# EAGLE design kicker (EAGLE 7.7.0)
DDRAWN: 4/30/17; FINISH: HASL; MATERIAL: FR-4; NDRAWN: RO; REV: 2.1; SCALE: 1:1; TITLE: SSL Kicker

## Sheet 1 of 7: Power Distribution
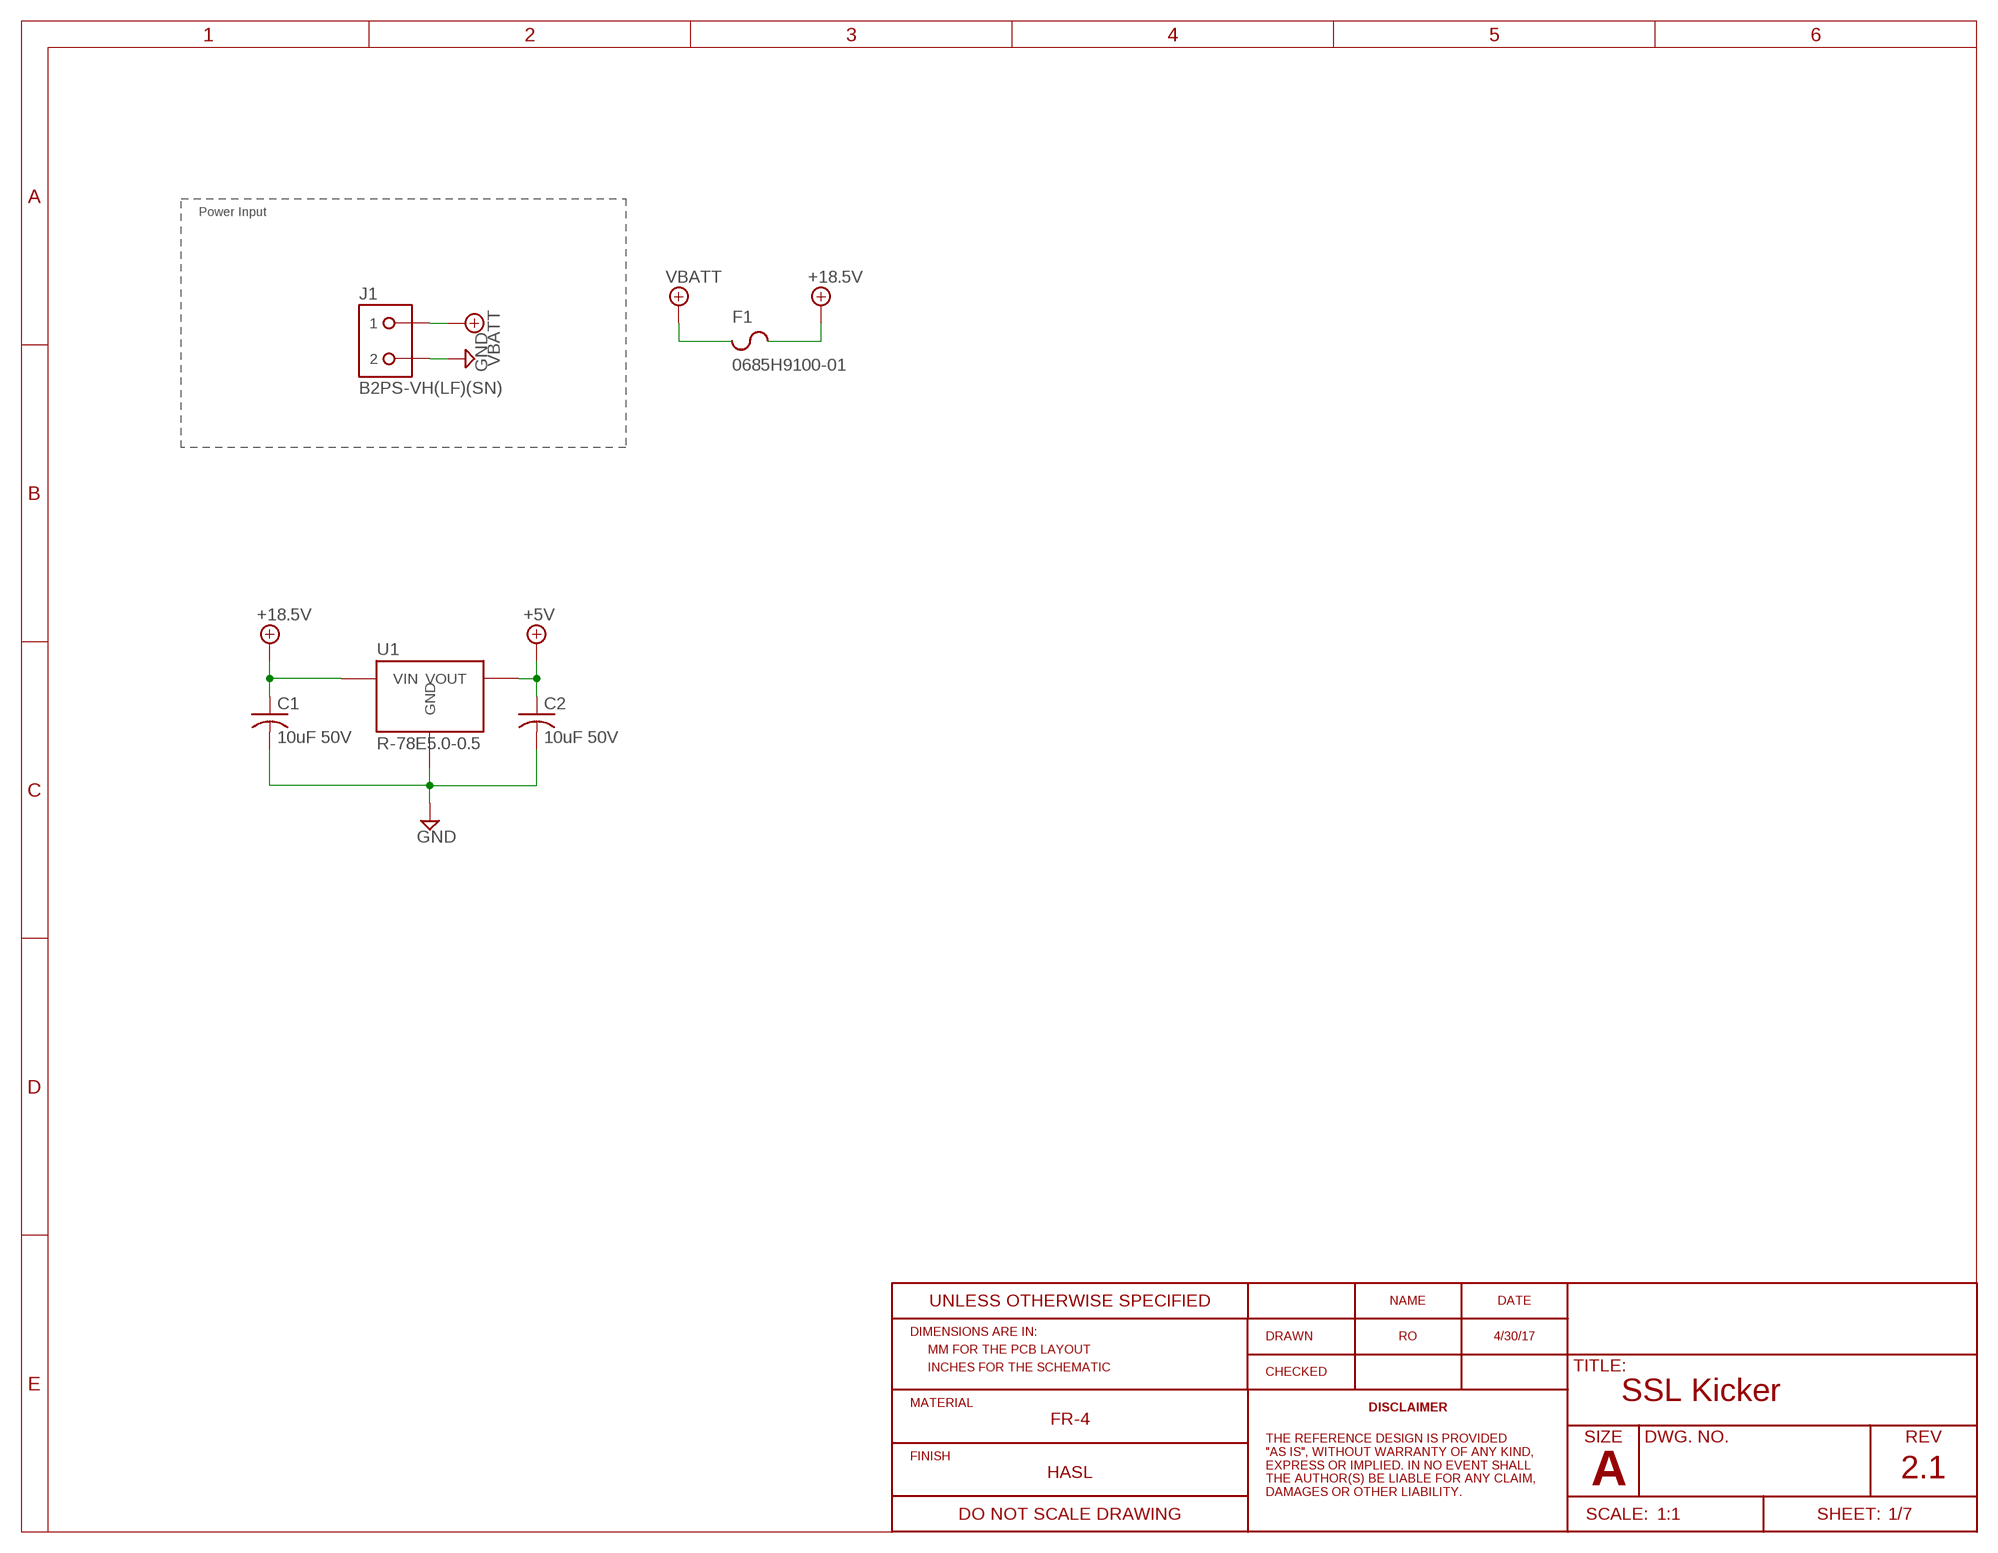
[diagram p0: schematic, sheet 1]

### Parts
C1  10uF 50V  C-USC0603  [C0603]
C2  10uF 50V  C-USC0603  [C0603]
F1  0685H9100-01  CHIP_FUSE1206  [F1206]
J1  B2PS-VH(LF)(SN)  [B2PS-CENTERED]
U1  R-78E5.0-0.5  [R-78E]

### Nets
+5V: C2.1 U1.3(VOUT) ; also sheet 3,5,6,7
+18.5V: C1.1 F1.2 U1.1(VIN) ; also sheet 2,3,4,5
GND: C1.2 C2.2 J1.2 U1.2(GND) ; also sheet 2,3,4,5,6,7
VBATT: F1.1 J1.1

### Notes on the sheet
- Power Input

## Sheet 2 of 7: High Voltage Converter
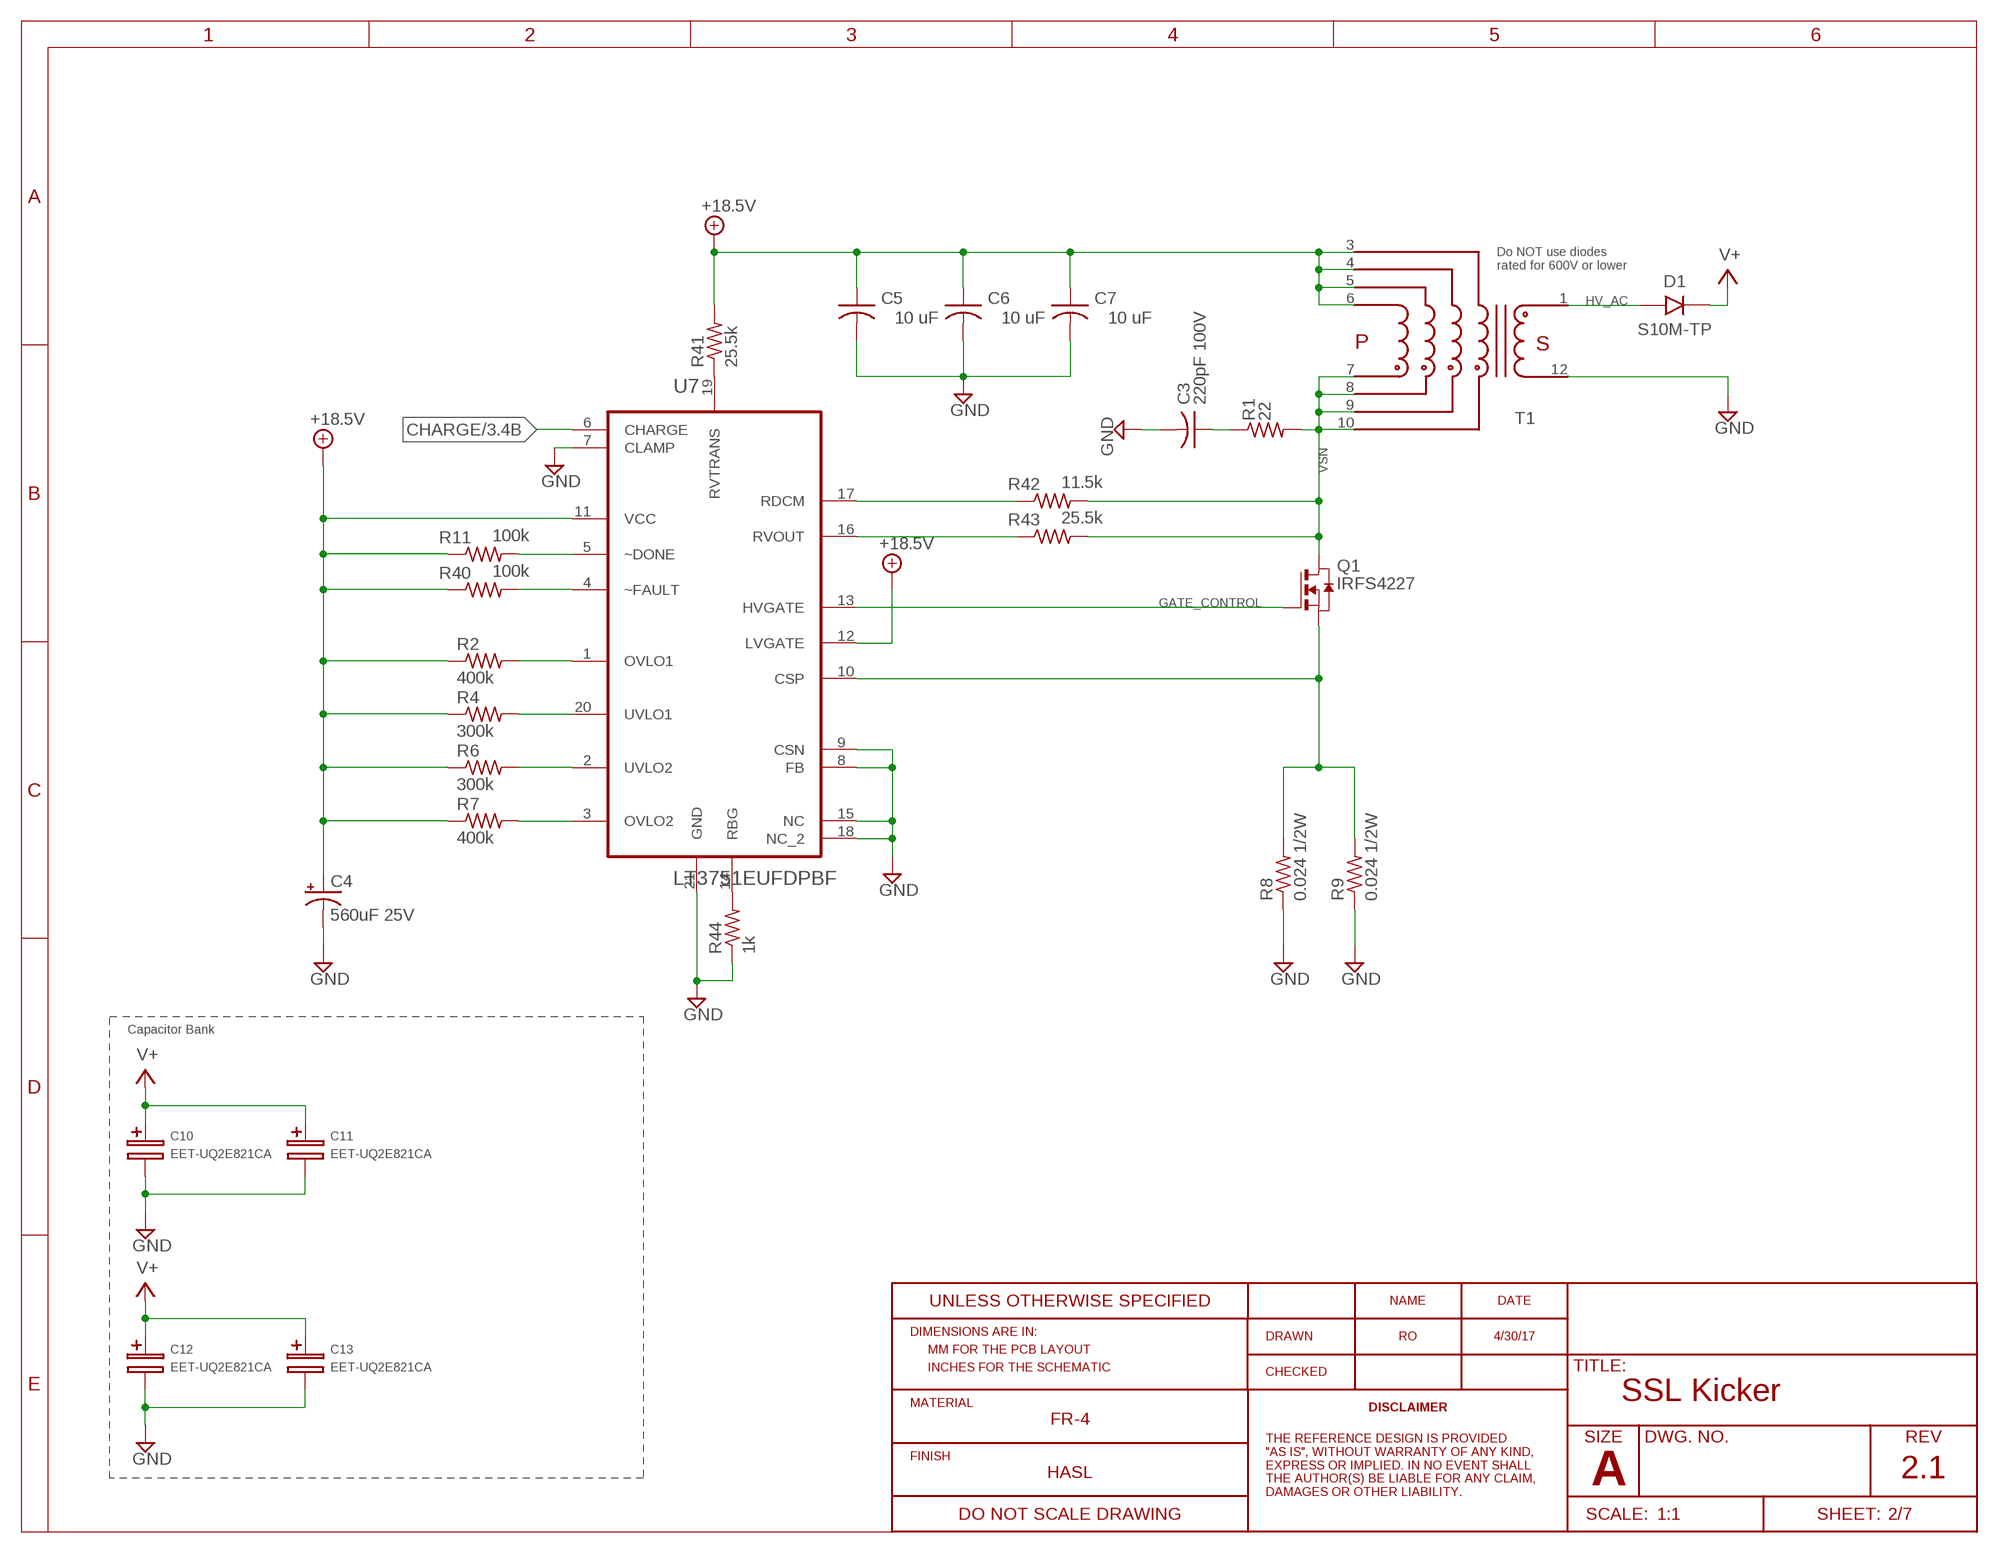
[diagram p1: schematic, sheet 2]

### Parts
C3  220pF 100V  C-USC0603  [C0603]
C4  560uF 25V  CPOL-USUD-10X10  [UD-10X10_NICHICON]
C5  10 uF  C-USC0603  [C0603]
C6  10 uF  C-USC0603  [C0603]
C7  10 uF  C-USC0603  [C0603]
C10  EET-UQ2E821CA  RC_CAPD25H40_HORIZ  [25MM-DIA_40MM-HGT_HORIZ]
C11  EET-UQ2E821CA  RC_CAPD25H40_HORIZ  [25MM-DIA_40MM-HGT_HORIZ]
C12  EET-UQ2E821CA  RC_CAPD25H40_HORIZ_R  [25MM-DIA_40MM-HGT_HORIZ_MIRRORED]
C13  EET-UQ2E821CA  RC_CAPD25H40_HORIZ_R  [25MM-DIA_40MM-HGT_HORIZ_MIRRORED]
D1  S10M-TP  [DO-214AB]
Q1  IRFS4227  [D2PAK]
R1  22  R-US_R0805  [R0805]
R2  400k  R-US_R0603  [R0603]
R4  300k  R-US_R0603  [R0603]
R6  300k  R-US_R0603  [R0603]
R7  400k  R-US_R0603  [R0603]
R8  0.024 1/2W  R-US_R1206  [R1206]
R9  0.024 1/2W  R-US_R1206  [R1206]
R11  100k  R-US_R0603  [R0603]
R40  100k  R-US_R0603  [R0603]
R41  25.5k  R-US_R0603  [R0603]
R42  11.5k  R-US_R0603  [R0603]
R43  25.5k  R-US_R0603  [R0603]
R44  1k  R-US_R0603  [R0603]
T1  DA203X-ALDA2034  [DA2034]
U7  LT3751EUFDPBF  [QFN50P400X500X80-21N]

### Nets
+18.5V: C4.+ C5.1 C6.1 C7.1 R2.1 R4.1 R6.1 R7.1 R11.1 R40.1 R41.2 T1.3 T1.4 T1.5 T1.6 U7.11(VCC) U7.12(LVGATE) ; also sheet 1,3,4,5
CHARGE: U7.6(CHARGE) ; also sheet 3,5
GATE_CONTROL: Q1.1(G) U7.13(HVGATE)
GND: C3.2 C4.- C5.2 C6.2 C7.2 C10.- C11.- C12.- C13.- R8.1 R9.1 R44.1 T1.12 U7.7(CLAMP) U7.8(FB) U7.9(CSN) U7.15(NC) U7.18(NC_2) U7.21(GND) ; also sheet 1,3,4,5,6,7
HV_AC: D1.A T1.1
N$1: R7.2 U7.3(OVLO2)
N$18: R6.2 U7.2(UVLO2)
N$19: R4.2 U7.20(UVLO1)
N$20: R2.2 U7.1(OVLO1)
N$22: R11.2 U7.5(~DONE)
N$23: R40.2 U7.4(~FAULT)
N$24: R41.1 U7.19(RVTRANS)
N$25: R42.1 U7.17(RDCM)
N$26: R43.1 U7.16(RVOUT)
N$27: R44.2 U7.14(RBG)
N$32: C3.1 R1.1
SENSE: Q1.3(S) R8.2 R9.2 U7.10(CSP)
V+: C10.+ C11.+ C12.+ C13.+ D1.C ; also sheet 3,4,5
VSN: Q1.2(D) R1.2 R42.2 R43.2 T1.7 T1.8 T1.9 T1.10

### Notes on the sheet
- Do NOT use diodes
  rated for 600V or lower
- Capacitor Bank

## Sheet 3 of 7: LED Indicators
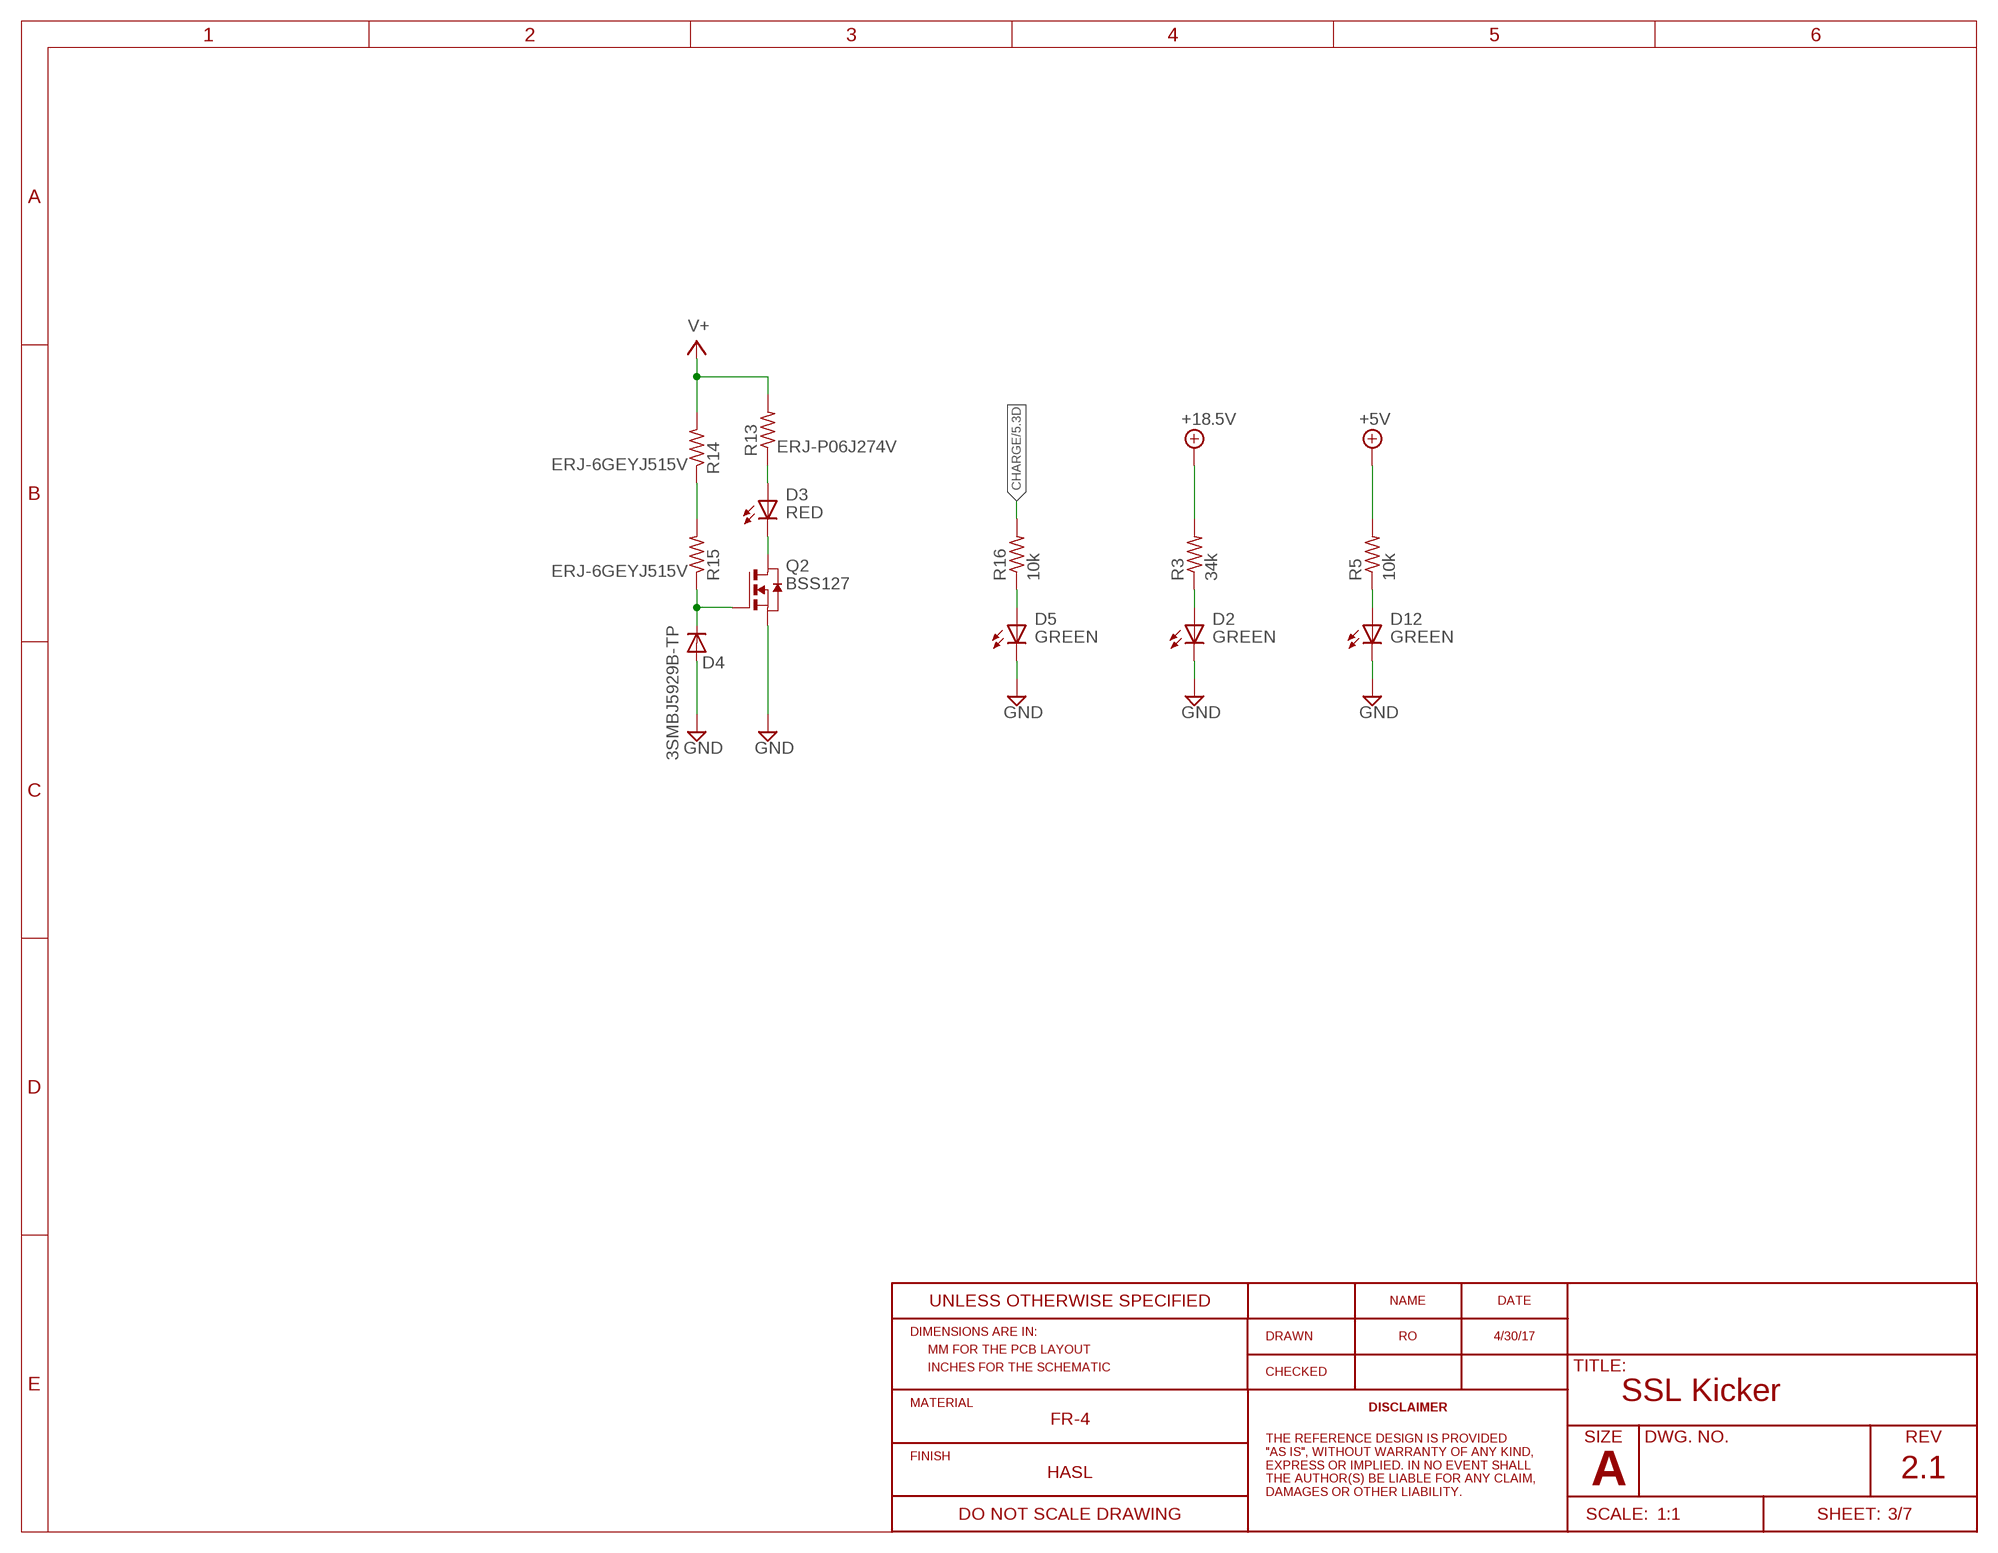
[diagram p2: schematic, sheet 3]

### Parts
D2  GREEN  LED-SMD-GREEN  [CHIP-LED0603]
D3  RED  LED-SMD-RED  [CHIP-LED0603]
D4  3SMBJ5929B-TP  DIODE-DO214AA  [DO214AA]
D5  GREEN  LED-SMD-GREEN  [CHIP-LED0603]
D12  GREEN  LED-SMD-GREEN  [CHIP-LED0603]
Q2  BSS127  [SOT-23-3]
R3  34k  R-US_R0603  [R0603]
R5  10k  R-US_R0603  [R0603]
R13  ERJ-P06J274V  R-US_R0805  [R0805]
R14  ERJ-6GEYJ515V  R-US_R0805  [R0805]
R15  ERJ-6GEYJ515V  R-US_R0805  [R0805]
R16  10k  R-US_R0603  [R0603]

### Nets
+5V: R5.2 ; also sheet 1,5,6,7
+18.5V: R3.2 ; also sheet 1,2,4,5
CHARGE: R16.2 ; also sheet 2,5
GND: D2.C(K) D4.A D5.C(K) D12.C(K) Q2.2(S) ; also sheet 1,2,4,5,6,7
N$3: D3.A R13.1
N$4: D3.C(K) Q2.3(D)
N$5: D5.A R16.1
N$11: R14.1 R15.2
N$21: D4.C Q2.1(G) R15.1
N$28: D2.A R3.1
N$29: D12.A R5.1
V+: R13.2 R14.2 ; also sheet 2,4,5

## Sheet 4 of 7: Auto Quick Discharge
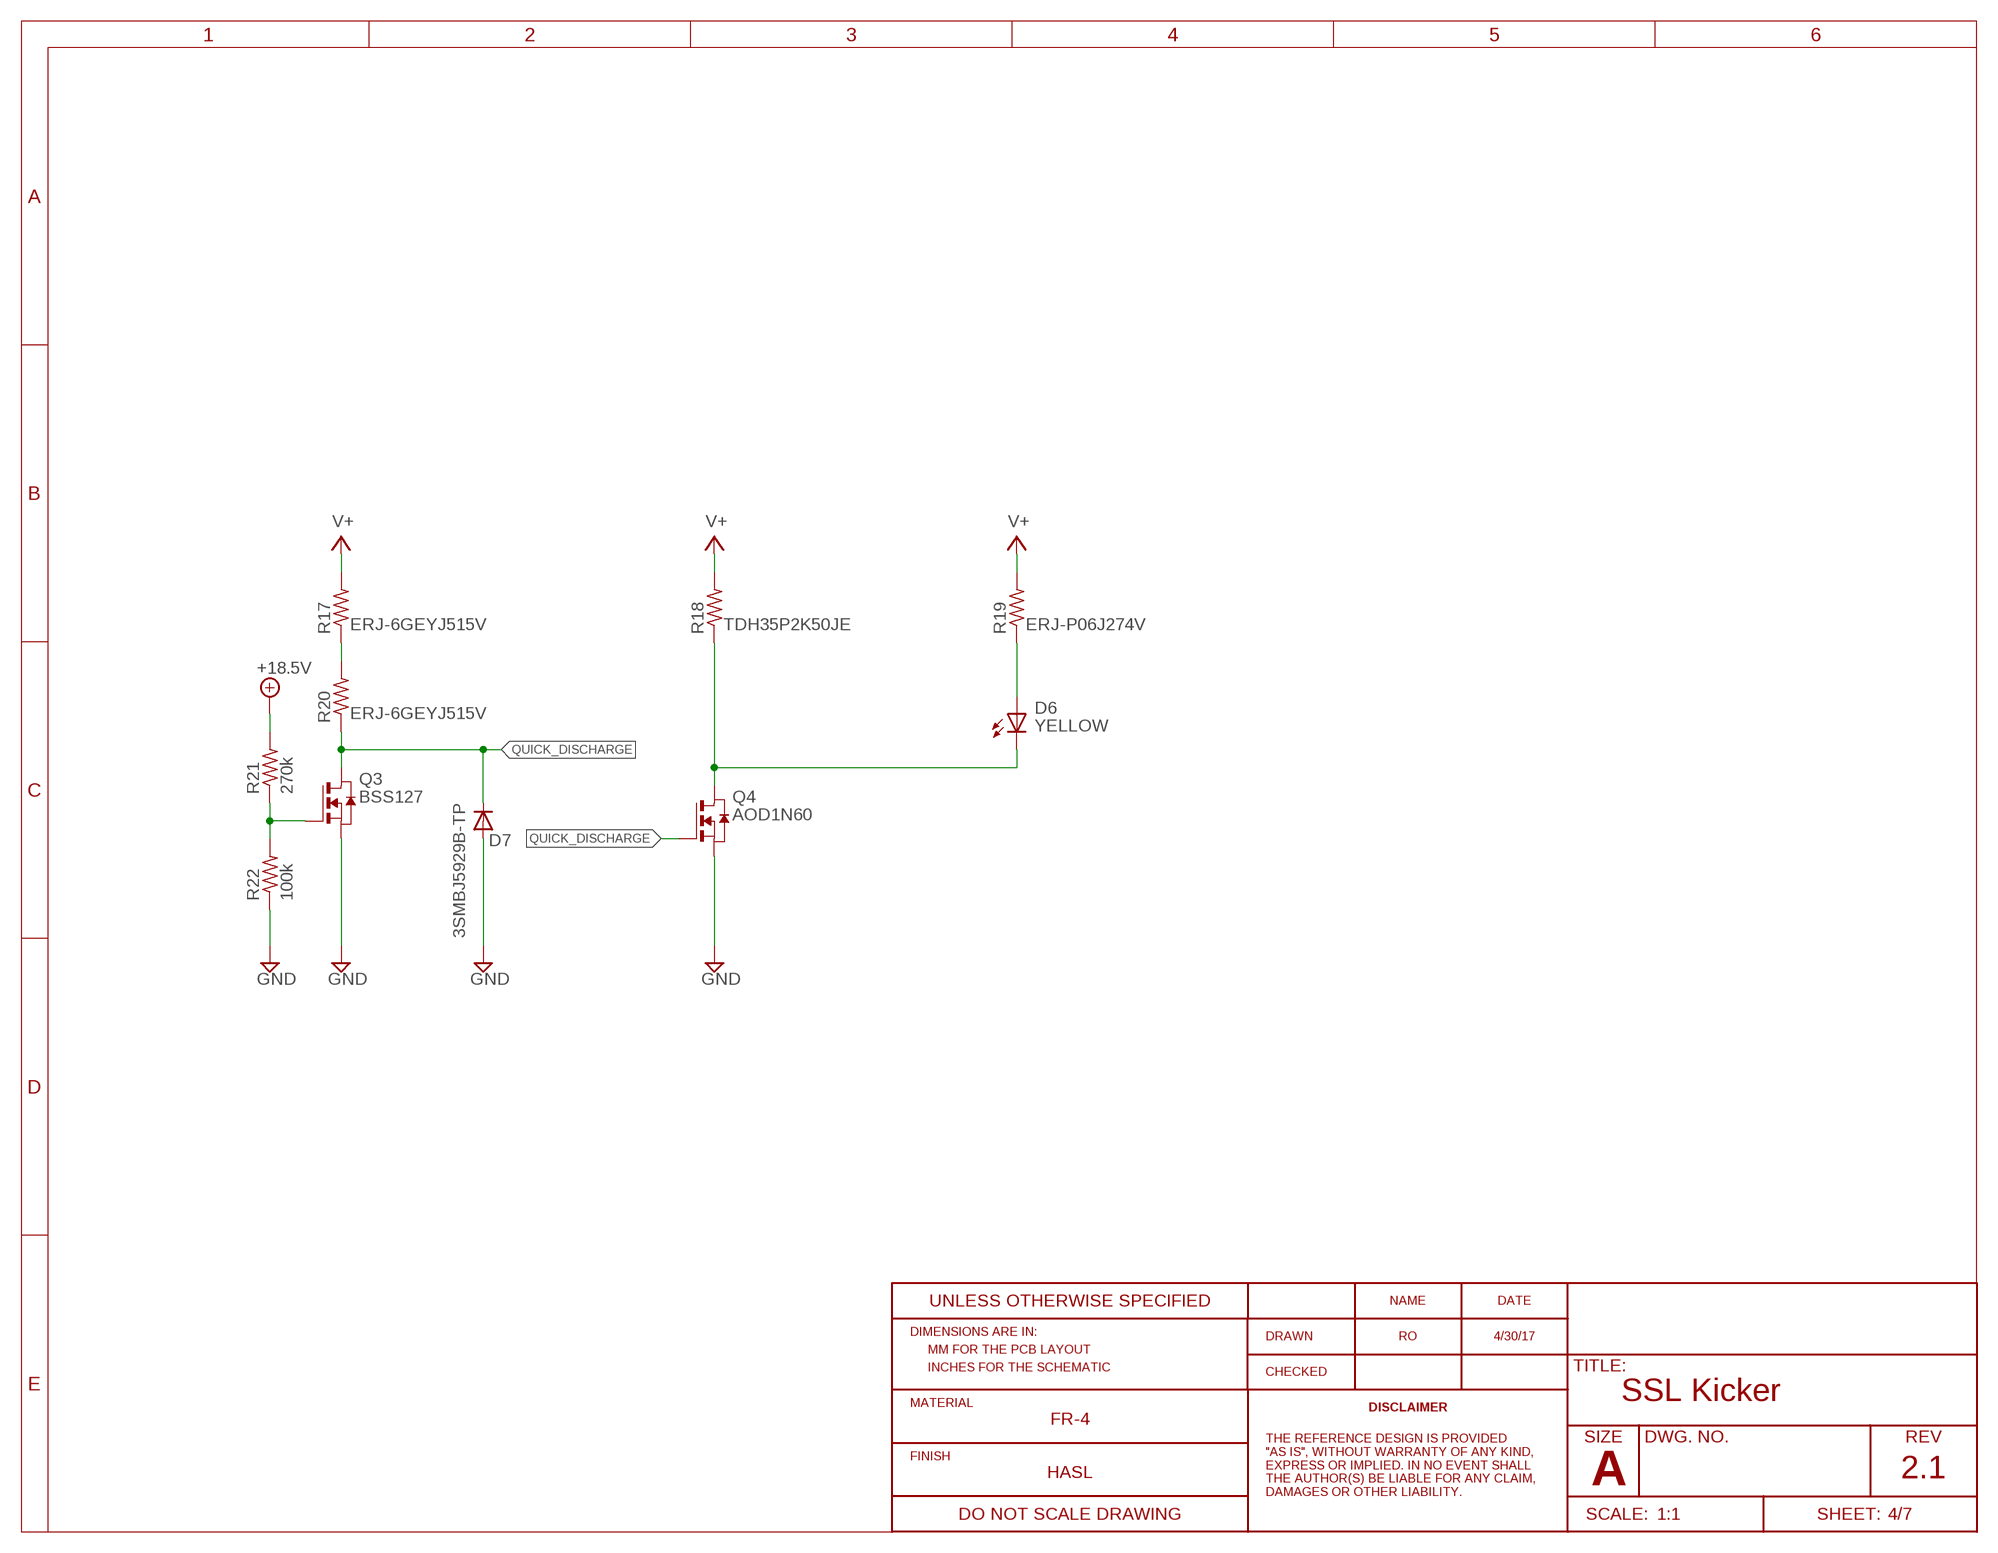
[diagram p3: schematic, sheet 4]

### Parts
D6  YELLOW  LED-SMD-YELLOW  [CHIP-LED0603]
D7  3SMBJ5929B-TP  DIODE-DO214AA  [DO214AA]
Q3  BSS127  [SOT-23-3]
Q4  AOD1N60  [DPAK]
R17  ERJ-6GEYJ515V  R-US_R0805  [R0805]
R18  TDH35P2K50JE  TDH35  [DPAK_TDH]
R19  ERJ-P06J274V  R-US_R0805  [R0805]
R20  ERJ-6GEYJ515V  R-US_R0805  [R0805]
R21  270k  R-US_R0603  [R0603]
R22  100k  R-US_R0603  [R0603]

### Nets
+18.5V: R21.2 ; also sheet 1,2,3,5
GND: D7.A Q3.2(S) Q4.3(S) R22.1 ; also sheet 1,2,3,5,6,7
N$2: R17.1 R20.2
N$10: Q3.1(G) R21.1 R22.2
N$12: D6.C(K) Q4.FIN(D) R18.1(PIN1)
N$13: D6.A R19.1
QUICK_DISCHARGE: D7.C Q3.3(D) Q4.1(G) R20.1
V+: R17.2 R18.2(PIN2) R19.2 ; also sheet 2,3,5

## Sheet 5 of 7: MCU
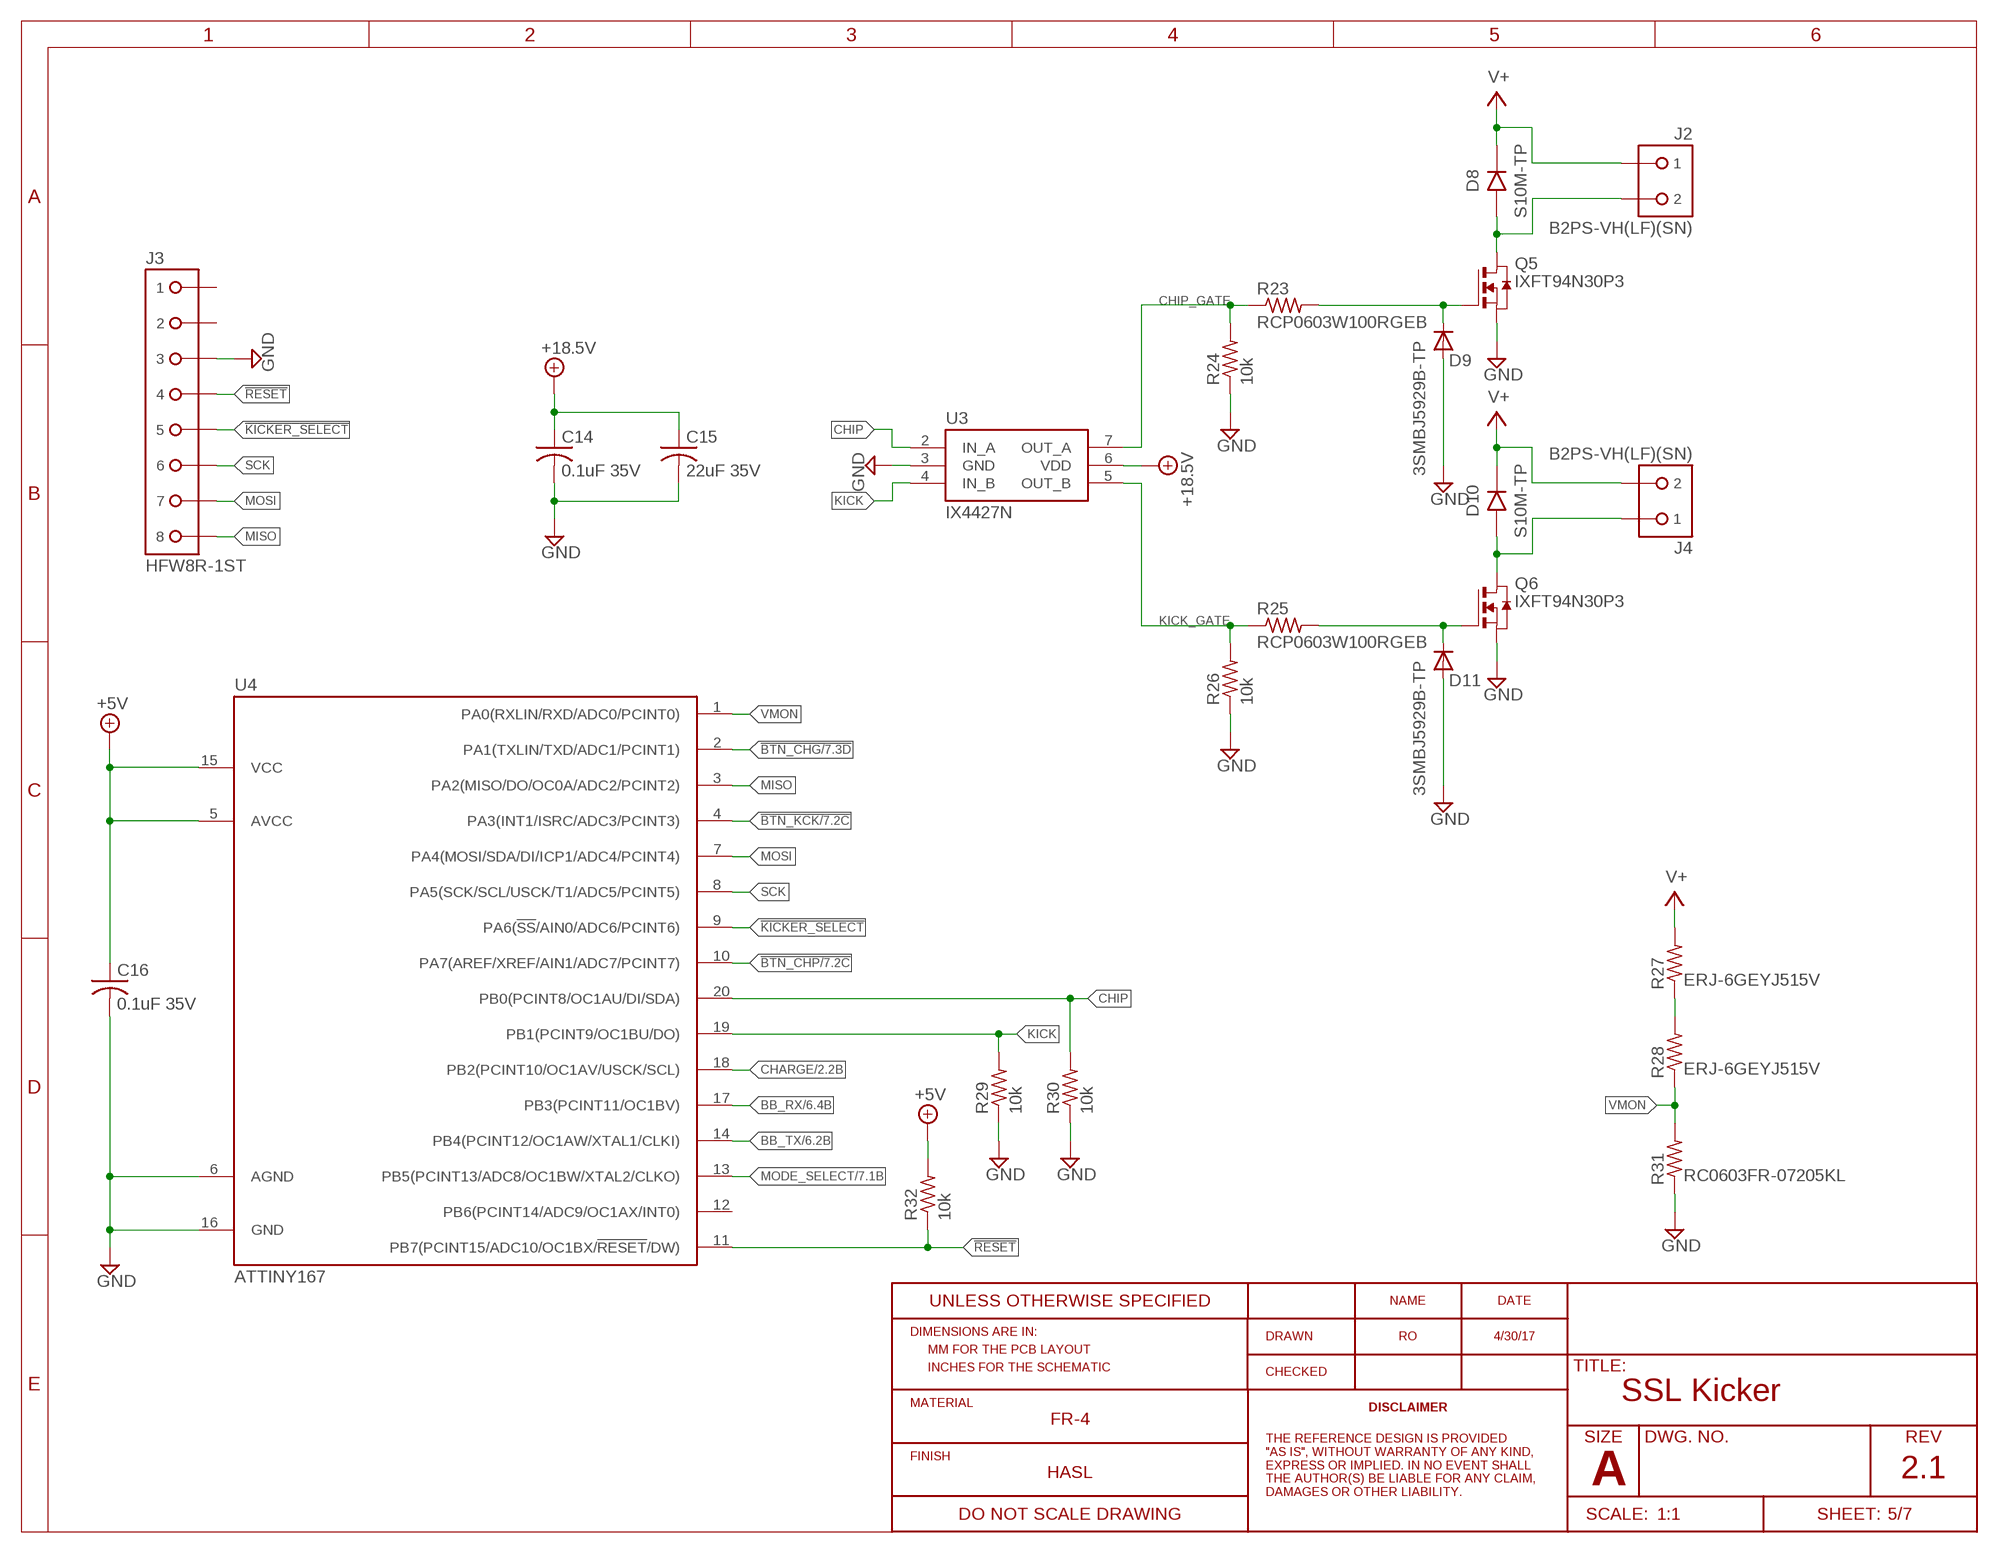
[diagram p4: schematic, sheet 5]

### Parts
C14  0.1uF 35V  C-USC0603  [C0603]
C15  22uF 35V  C-USC0805  [C0805]
C16  0.1uF 35V  C-USC0603  [C0603]
D8  S10M-TP  [DO-214AB]
D9  3SMBJ5929B-TP  DIODE-DO214AA  [DO214AA]
D10  S10M-TP  [DO-214AB]
D11  3SMBJ5929B-TP  DIODE-DO214AA  [DO214AA]
J2  B2PS-VH(LF)(SN)  [B2PS-CENTERED]
J3  HFW8R-1ST  [HFW8R-1ST]
J4  B2PS-VH(LF)(SN)  [B2PS-CENTERED]
Q5  IXFT94N30P3  [TO-268]
Q6  IXFT94N30P3  [TO-268]
R23  RCP0603W100RGEB  R0603W  [R0603W]
R24  10k  R-US_R0603  [R0603]
R25  RCP0603W100RGEB  R0603W  [R0603W]
R26  10k  R-US_R0603  [R0603]
R27  ERJ-6GEYJ515V  R-US_R0805  [R0805]
R28  ERJ-6GEYJ515V  R-US_R0805  [R0805]
R29  10k  R-US_R0603  [R0603]
R30  10k  R-US_R0603  [R0603]
R31  RC0603FR-07205KL  R-US_R0603  [R0603]
R32  10k  R-US_R0603  [R0603]
U3  IX4427N  [SOIC-8]
U4  ATTINY167  [SOIC-20]

### Nets
!BTN_CHG: U4.2(PA1(TXLIN/TXD/ADC1/PCINT1)) ; also sheet 7
!BTN_CHP: U4.10(PA7(AREF/XREF/AIN1/ADC7/PCINT7)) ; also sheet 7
!BTN_KCK: U4.4(PA3(INT1/ISRC/ADC3/PCINT3)) ; also sheet 7
!KICKER_SELECT: J3.5 U4.9(PA6(!SS!/AIN0/ADC6/PCINT6))
!RESET: J3.4 R32.1 U4.11(PB7(PCINT15/ADC10/OC1BX/!RESET!/DW))
+5V: C16.1 R32.2 U4.5(AVCC) U4.15(VCC) ; also sheet 1,3,6,7
+18.5V: C14.1 C15.1 U3.6(VDD) ; also sheet 1,2,3,4
BB_RX: U4.17(PB3(PCINT11/OC1BV)) ; also sheet 6
BB_TX: U4.14(PB4(PCINT12/OC1AW/XTAL1/CLKI)) ; also sheet 6
CHARGE: U4.18(PB2(PCINT10/OC1AV/USCK/SCL)) ; also sheet 2,3
CHIP: R30.2 U3.2(IN_A) U4.20(PB0(PCINT8/OC1AU/DI/SDA))
CHIP_GATE: R23.1(PIN1) R24.2 U3.7(OUT_A)
CHIPPER: D8.A J2.2 Q5.4(D)
GND: C14.2 C15.2 C16.2 D9.A D11.A J3.3 Q5.3(S) Q6.3(S) R24.1 R26.1 R29.1 R30.1 R31.1 U3.3(GND) U4.6(AGND) U4.16(GND) ; also sheet 1,2,3,4,6,7
KICK: R29.2 U3.4(IN_B) U4.19(PB1(PCINT9/OC1BU/DO))
KICK_GATE: R25.1(PIN1) R26.2 U3.5(OUT_B)
KICKER: D10.A J4.1 Q6.4(D)
MISO: J3.8 U4.3(PA2(MISO/DO/OC0A/ADC2/PCINT2))
MODE_SELECT: U4.13(PB5(PCINT13/ADC8/OC1BW/XTAL2/CLKO)) ; also sheet 7
MOSI: J3.7 U4.7(PA4(MOSI/SDA/DI/ICP1/ADC4/PCINT4))
N$7: D9.C Q5.1(G) R23.2(PIN2)
N$8: D11.C Q6.1(G) R25.2(PIN2)
N$15: R27.1 R28.2
SCK: J3.6 U4.8(PA5(SCK/SCL/USCK/T1/ADC5/PCINT5))
V+: D8.C D10.C J2.1 J4.2 R27.2 ; also sheet 2,3,4
VMON: R28.1 R31.2 U4.1(PA0(RXLIN/RXD/ADC0/PCINT0))
Unconnected: J3.1 J3.2 J3.LEG1 J3.LEG2 U4.12(PB6(PCINT14/ADC9/OC1AX/INT0))

## Sheet 6 of 7: Breakbeam
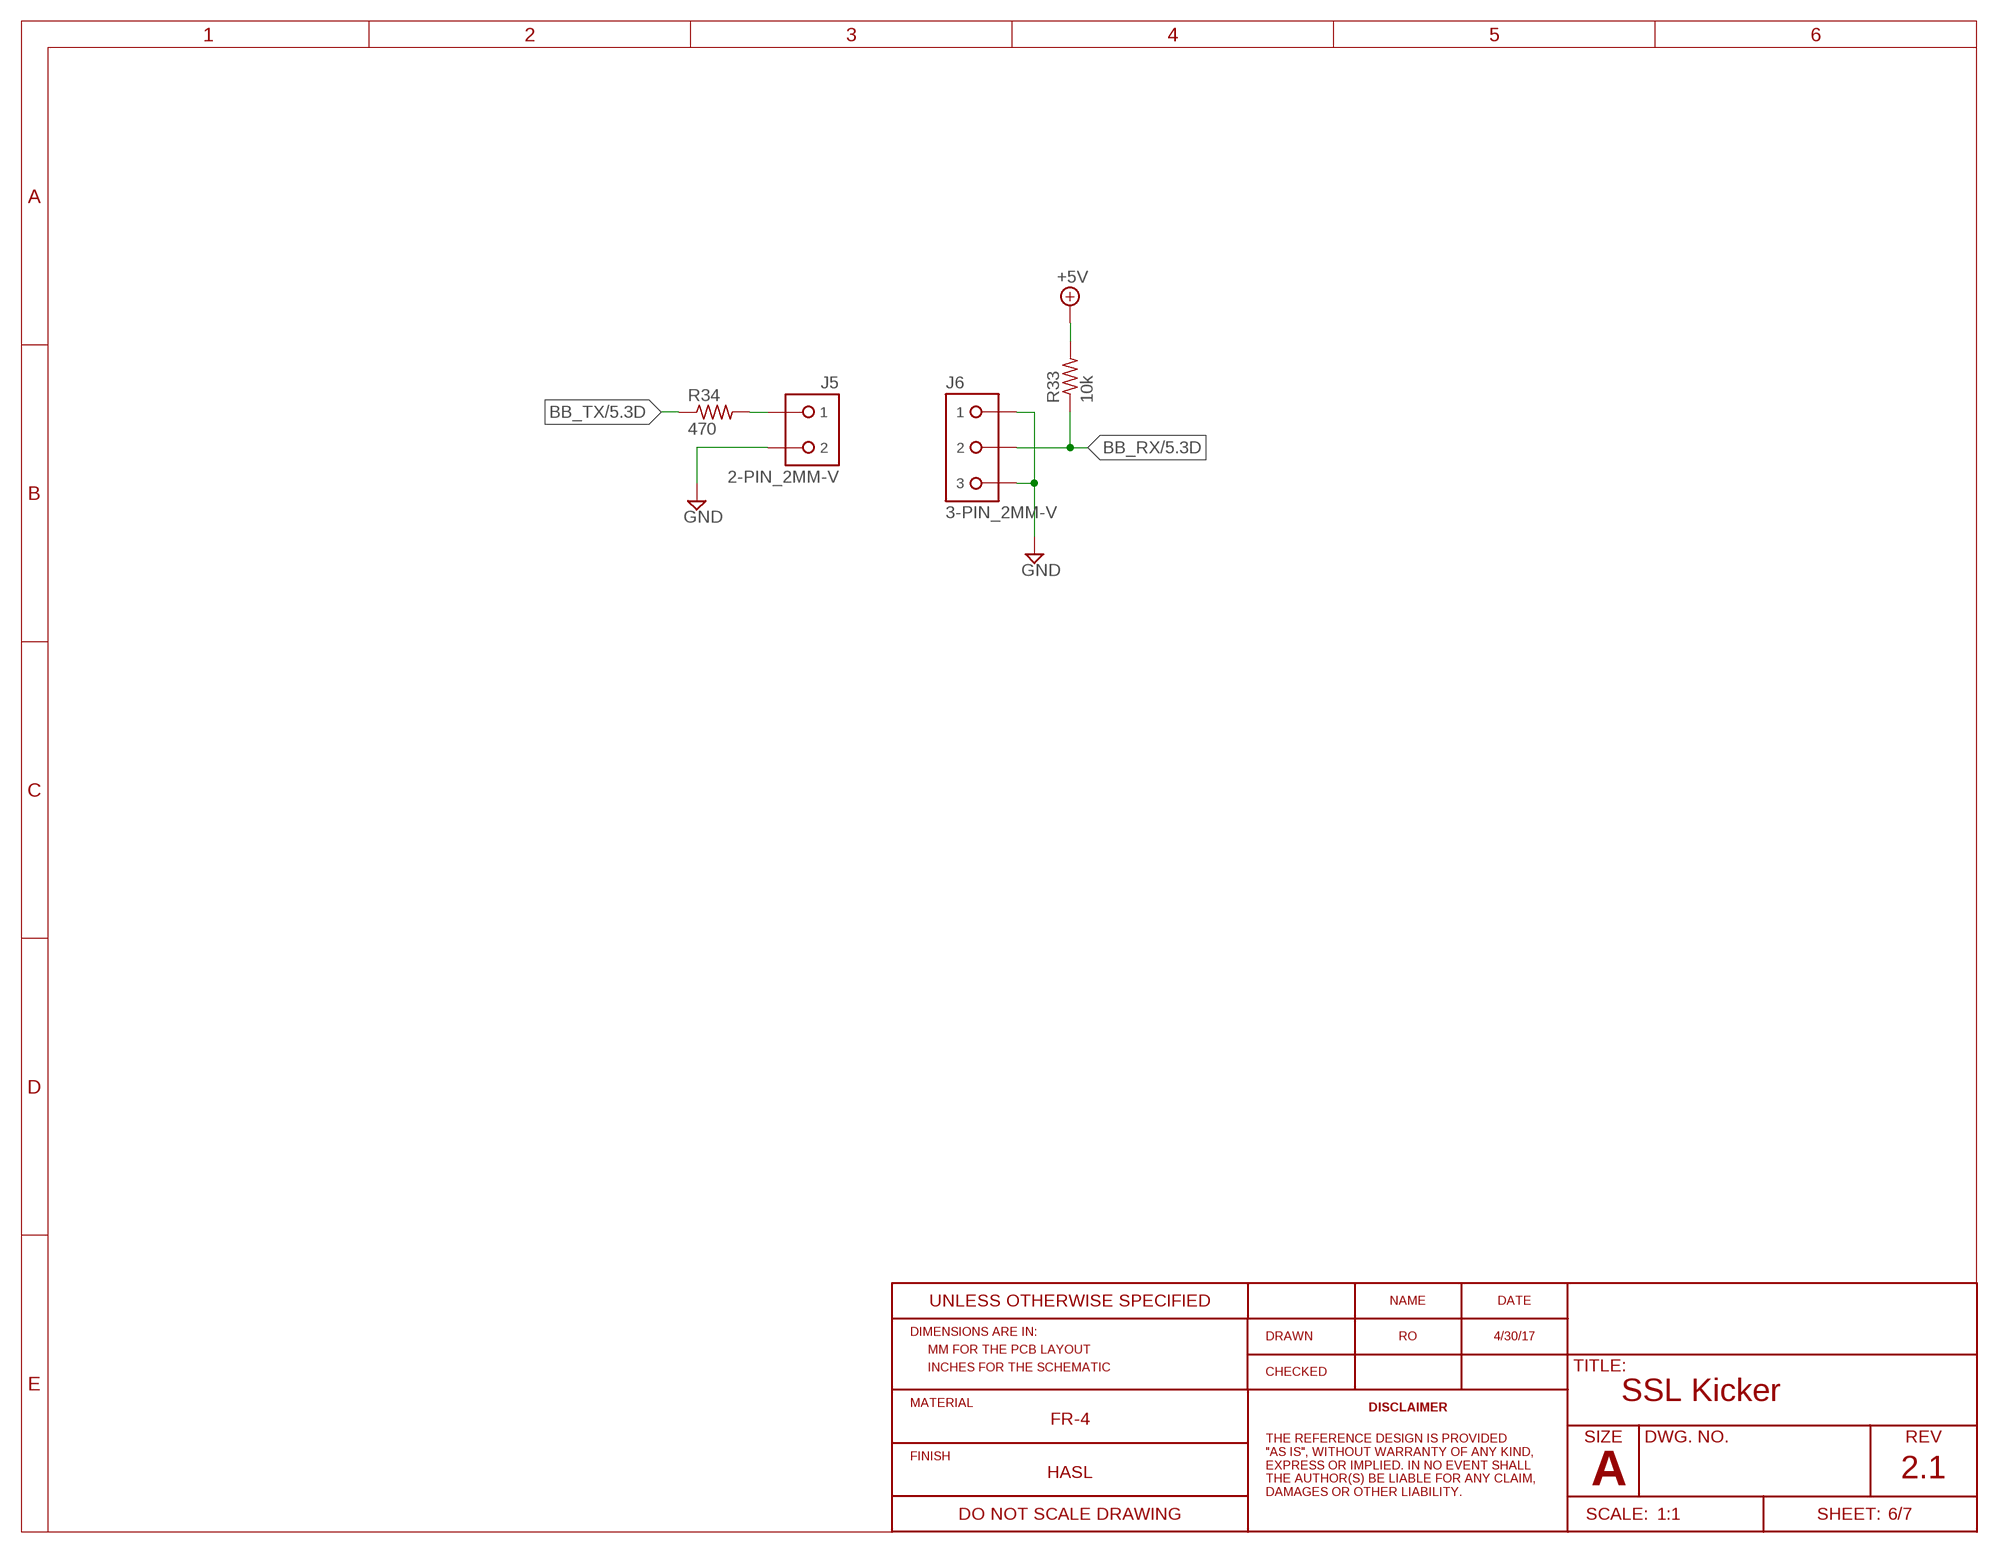
[diagram p5: schematic, sheet 6]

### Parts
J5  2-PIN_2MM-V  [2MM-2-V]
J6  3-PIN_2MM-V  [2MM-3-V]
R33  10k  R-US_R0603  [R0603]
R34  470  R-US_R0603  [R0603]

### Nets
+5V: R33.2 ; also sheet 1,3,5,7
BB_RX: J6.2 R33.1 ; also sheet 5
BB_TX: R34.1 ; also sheet 5
GND: J5.2 J6.1 J6.3 ; also sheet 1,2,3,4,5,7
N$6: J5.1 R34.2

## Sheet 7 of 7: User Input
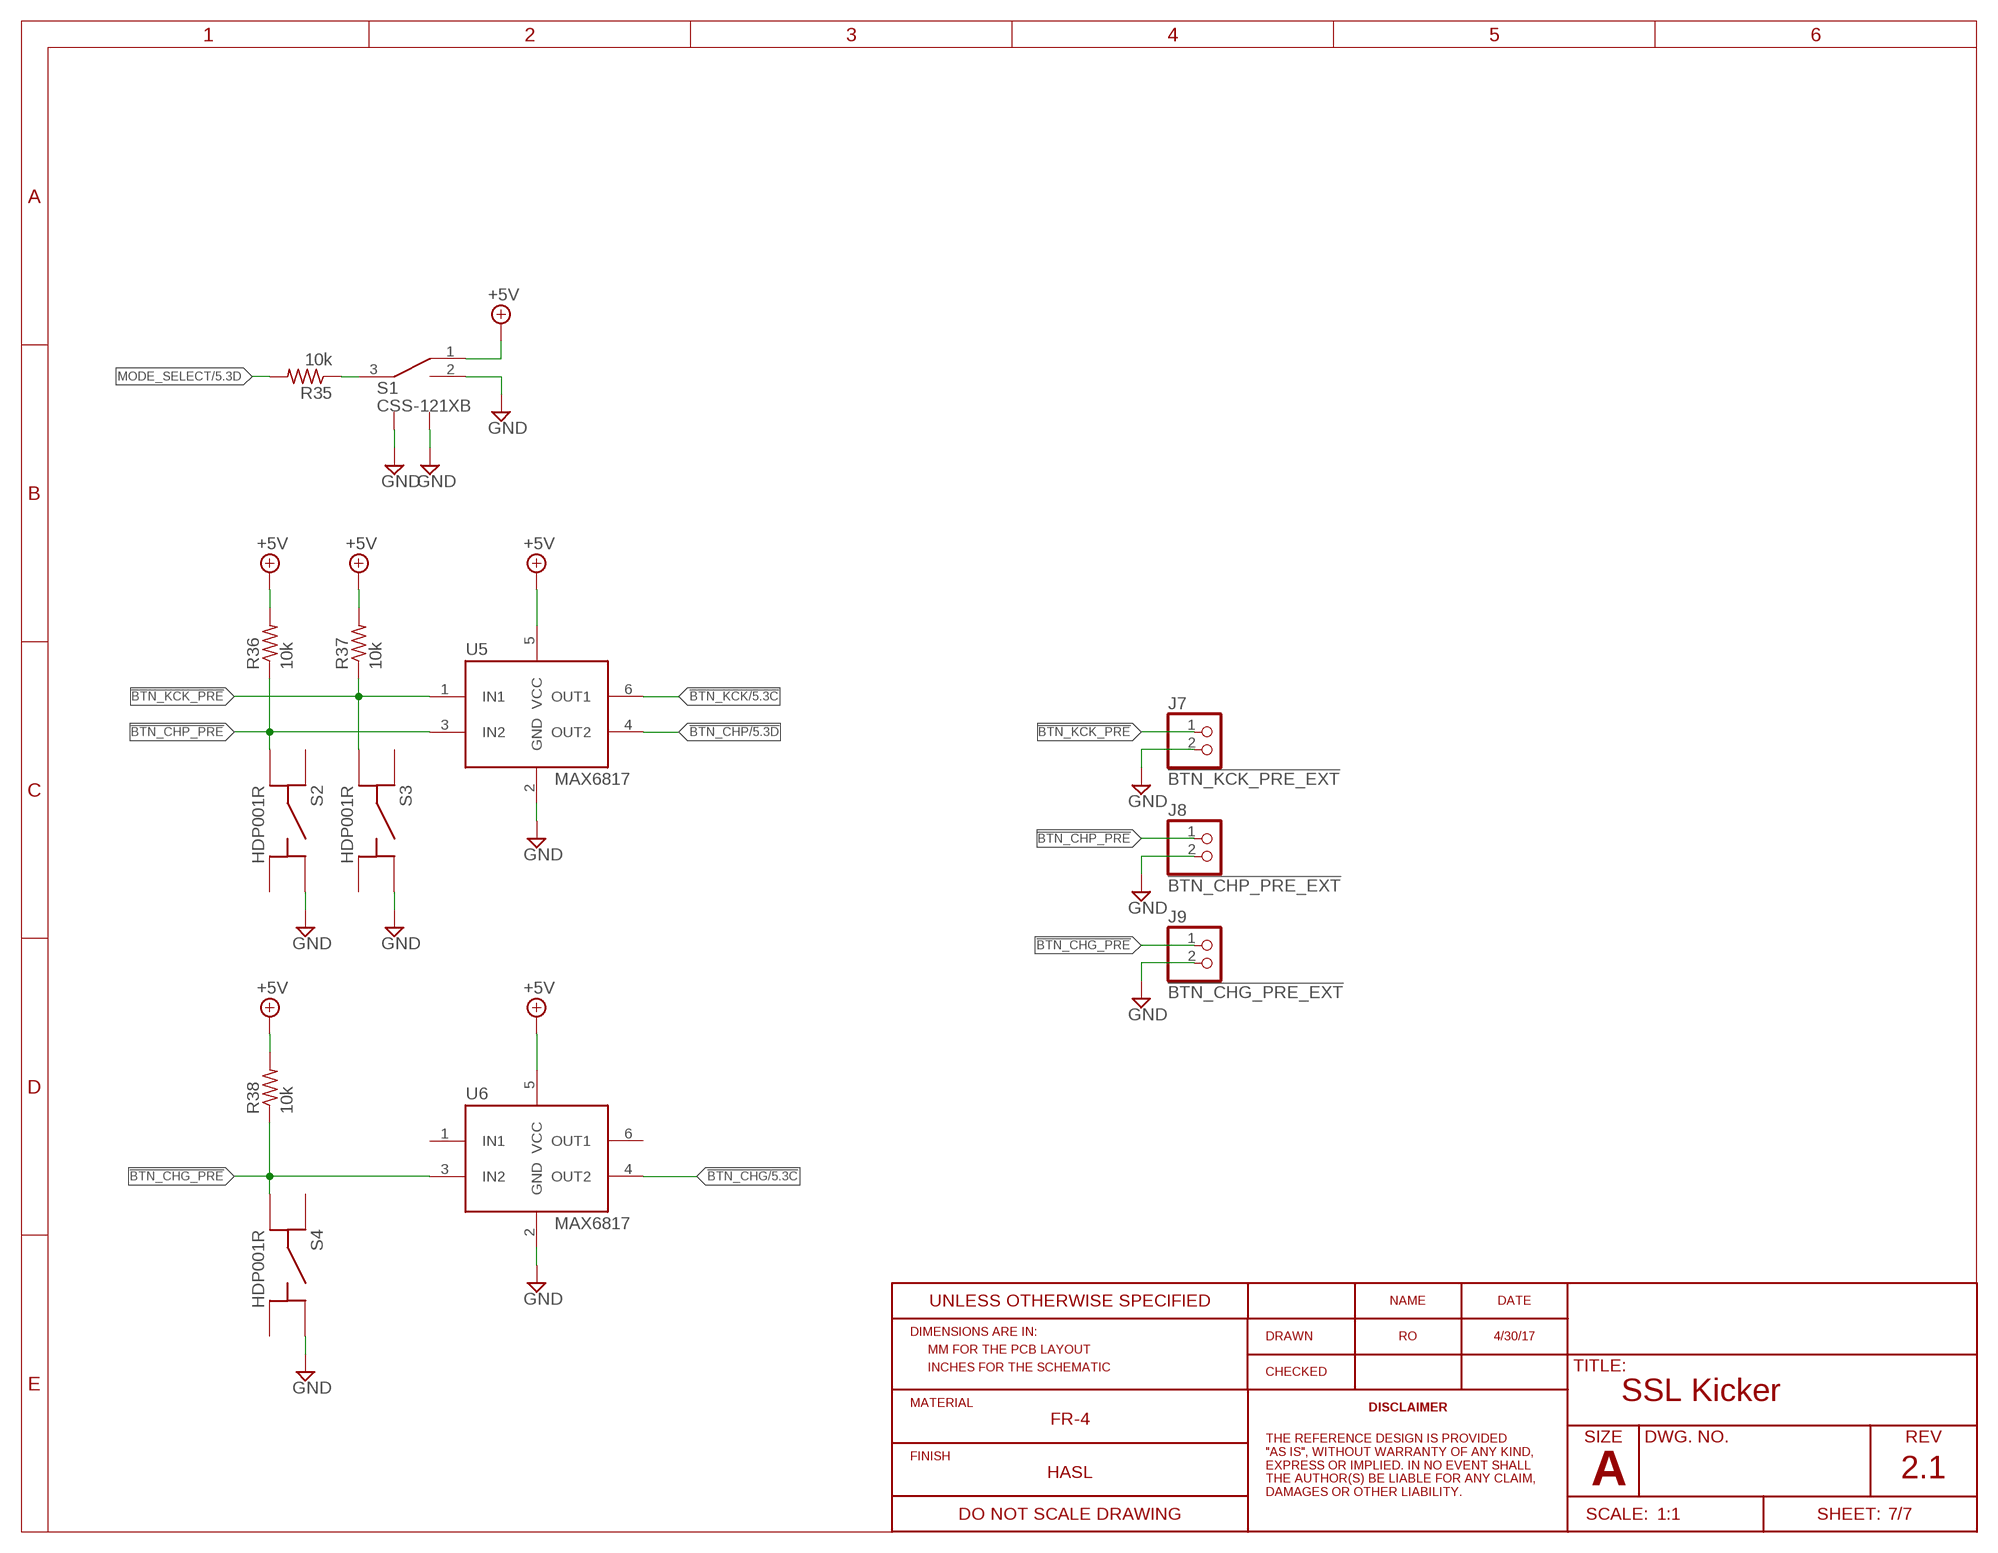
[diagram p6: schematic, sheet 7]

### Parts
J7  !BTN_KCK_PRE_EXT  CONN-2VERT  [1X2]
J8  !BTN_CHP_PRE_EXT  CONN-2VERT  [1X2]
J9  !BTN_CHG_PRE_EXT  CONN-2VERT  [1X2]
R35  10k  R-US_R0603  [R0603]
R36  10k  R-US_R0603  [R0603]
R37  10k  R-US_R0603  [R0603]
R38  10k  R-US_R0603  [R0603]
S1  CSS-121XB  [CSS-121XB]
S2  HDP001R  [HDP001R]
S3  HDP001R  [HDP001R]
S4  HDP001R  [HDP001R]
U5  MAX6817  [SOT-23-6]
U6  MAX6817  [SOT-23-6]

### Nets
!BTN_CHG: U6.4(OUT2) ; also sheet 5
!BTN_CHG_PRE: J9.1 R38.1 S4.C(A2) U6.3(IN2)
!BTN_CHP: U5.4(OUT2) ; also sheet 5
!BTN_CHP_PRE: J8.1 R36.1 S2.C(A2) U5.3(IN2)
!BTN_KCK: U5.6(OUT1) ; also sheet 5
!BTN_KCK_PRE: J7.1 R37.1 S3.C(A2) U5.1(IN1)
+5V: R36.2 R37.2 R38.2 S1.1(A) U5.5(VCC) U6.5(VCC) ; also sheet 1,3,5,6
GND: J7.2 J8.2 J9.2 S1.2(B) S1.LEG1 S1.LEG4(LEG2) S2.B(B1) S3.B(B1) S4.B(B1) U5.2(GND) U6.2(GND) ; also sheet 1,2,3,4,5,6
MODE_SELECT: R35.2 ; also sheet 5
N$14: R35.1 S1.3(COMMON)
Unconnected: S2.A(A1) S2.D(B2) S3.A(A1) S3.D(B2) S4.A(A1) S4.D(B2) U6.1(IN1) U6.6(OUT1)

## Library data of the parts
C1-C3 C5-C7 C14-C16 = rcl:C-US: CAPACITOR, American symbol
C4 = rcl:CPOL-US: POLARIZED CAPACITOR, American symbol
C10-C13 = RoboJackets-Capacitors:RC_CAP
D1 D8 D10 = RoboJackets-Diodes:S10M-?
D2 D5 D12 = RoboJackets-LEDs:LED-SMD; DIGIKEY: 160-1446-1-ND; MPN: LTST-C191KGKT
D3 = RoboJackets-LEDs:LED-SMD; DIGIKEY: 160-1447-1-ND; MPN: LTST-C191KRKT
D4 D7 D9 D11 = RoboJackets-Diodes:DIODE-: DIODE
D6 = RoboJackets-LEDs:LED-SMD; DIGIKEY: 160-1448-1-ND; MPN: LTST-C191KSKT
F1 = RoboJackets-Fuses:CHIP_FUSE
J1 J2 J4 = RoboJackets-Connectors:B2P?-VH(LF)(SN): Power Connector Brand: JST Sales America Inc. <https://www.jst.com/> Series: VH <http://www.digikey.com/product-search/en?FV=fff40016,fff802f3,ffec0e9d> Distributor: Digi-Key <http://www.digikey.com/product-detail/en/B2PS-VH%28LF%29%28SN%29/455-1648-ND/926555>; DIGIKEY: 455-1648-ND; MPN: B2PS-VH(LF)(SN)
J3 = RoboJackets-Connectors:HFW8; DIGIKEY: 609-1788-1-ND; MPN: HFW8R-1STE1LF
J5 = RoboJackets-Connectors:2-PIN_2MM-*; PINS: 2; PIN_PITCH: 2.0 mm
J6 = RoboJackets-Connectors:3-PIN_2MM-*; PINS: 3; PIN_PITCH: 2.0 mm
J7-J9 = RoboJackets-Connectors:CONN-2
Q1 = RoboJackets-Discrete:IRFS4227
Q2 Q3 = RoboJackets-Discrete:BSS127
Q4 = RoboJackets-Discrete:AOD1N60
Q5 Q6 = RoboJackets-Discrete:IXF?94N30P3
R1-R9 R11 R13-R17 R19-R22 R24 R26-R38 R40-R44 = rcl:R-US_: RESISTOR, American symbol
R18 = RoboJackets-Resistors:TDH35
R23 R25 = RoboJackets-Resistors:R0603W
S1 = RoboJackets-Switches:CSS-121XB
S2-S4 = RoboJackets-Switches:HDP001?
T1 = RoboJackets-Inductors:DA203X-AL
U1 = RoboJackets-PowerICs:R-78E5.0-0.5
U3 = RoboJackets-PowerICs:IX4427
U4 = RoboJackets-ICs:ATTINY167; DIGIKEY: ATTINY167-SU-ND; MPN: ATTINY167-SU
U5 U6 = RoboJackets-ICs:MAX6817
U7 = LTC_By_element14_Batch_1:LT3751EUFDPBF: Charger Controller with Regulation; MPN: LT3751EUFD#PBF; OC_FARNELL: -; OC_NEWARK: 31P7617; PACKAGE: QFN-24; SUPPLIER: Linear Technology

## Board
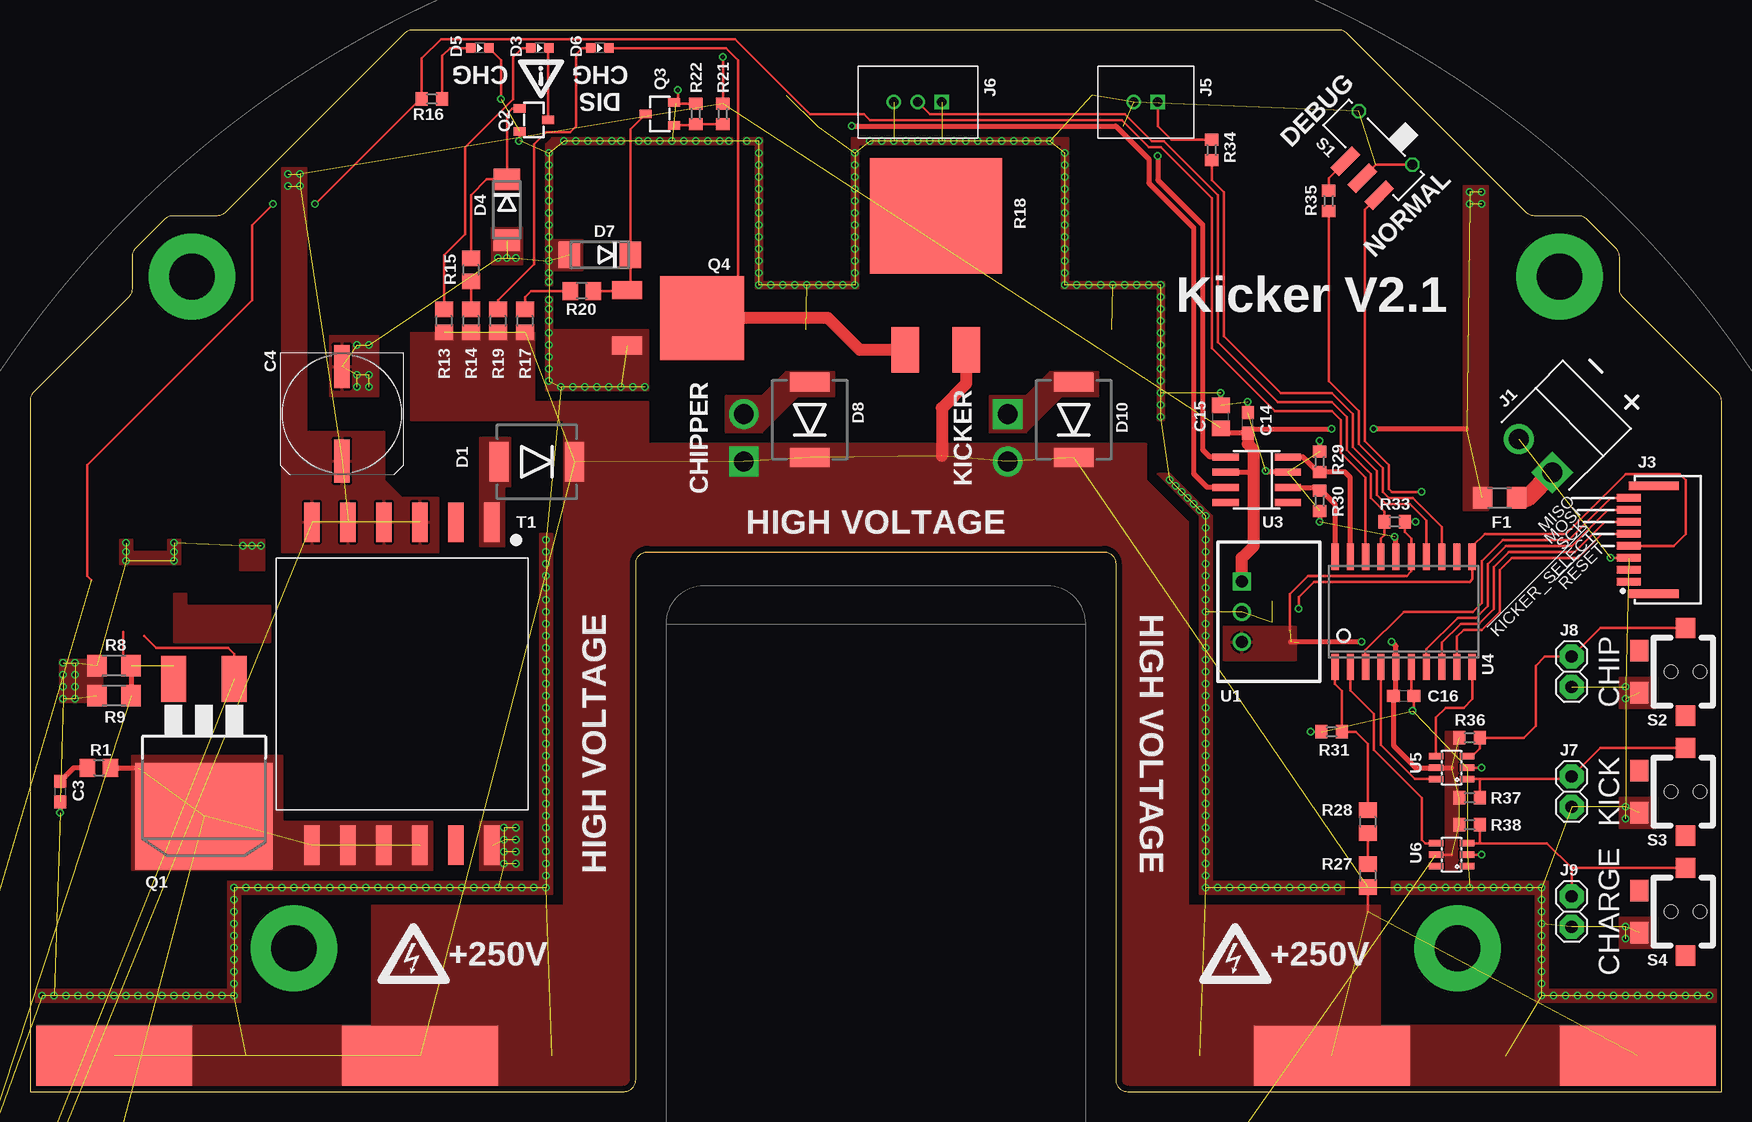
[diagram p7: board, top side]
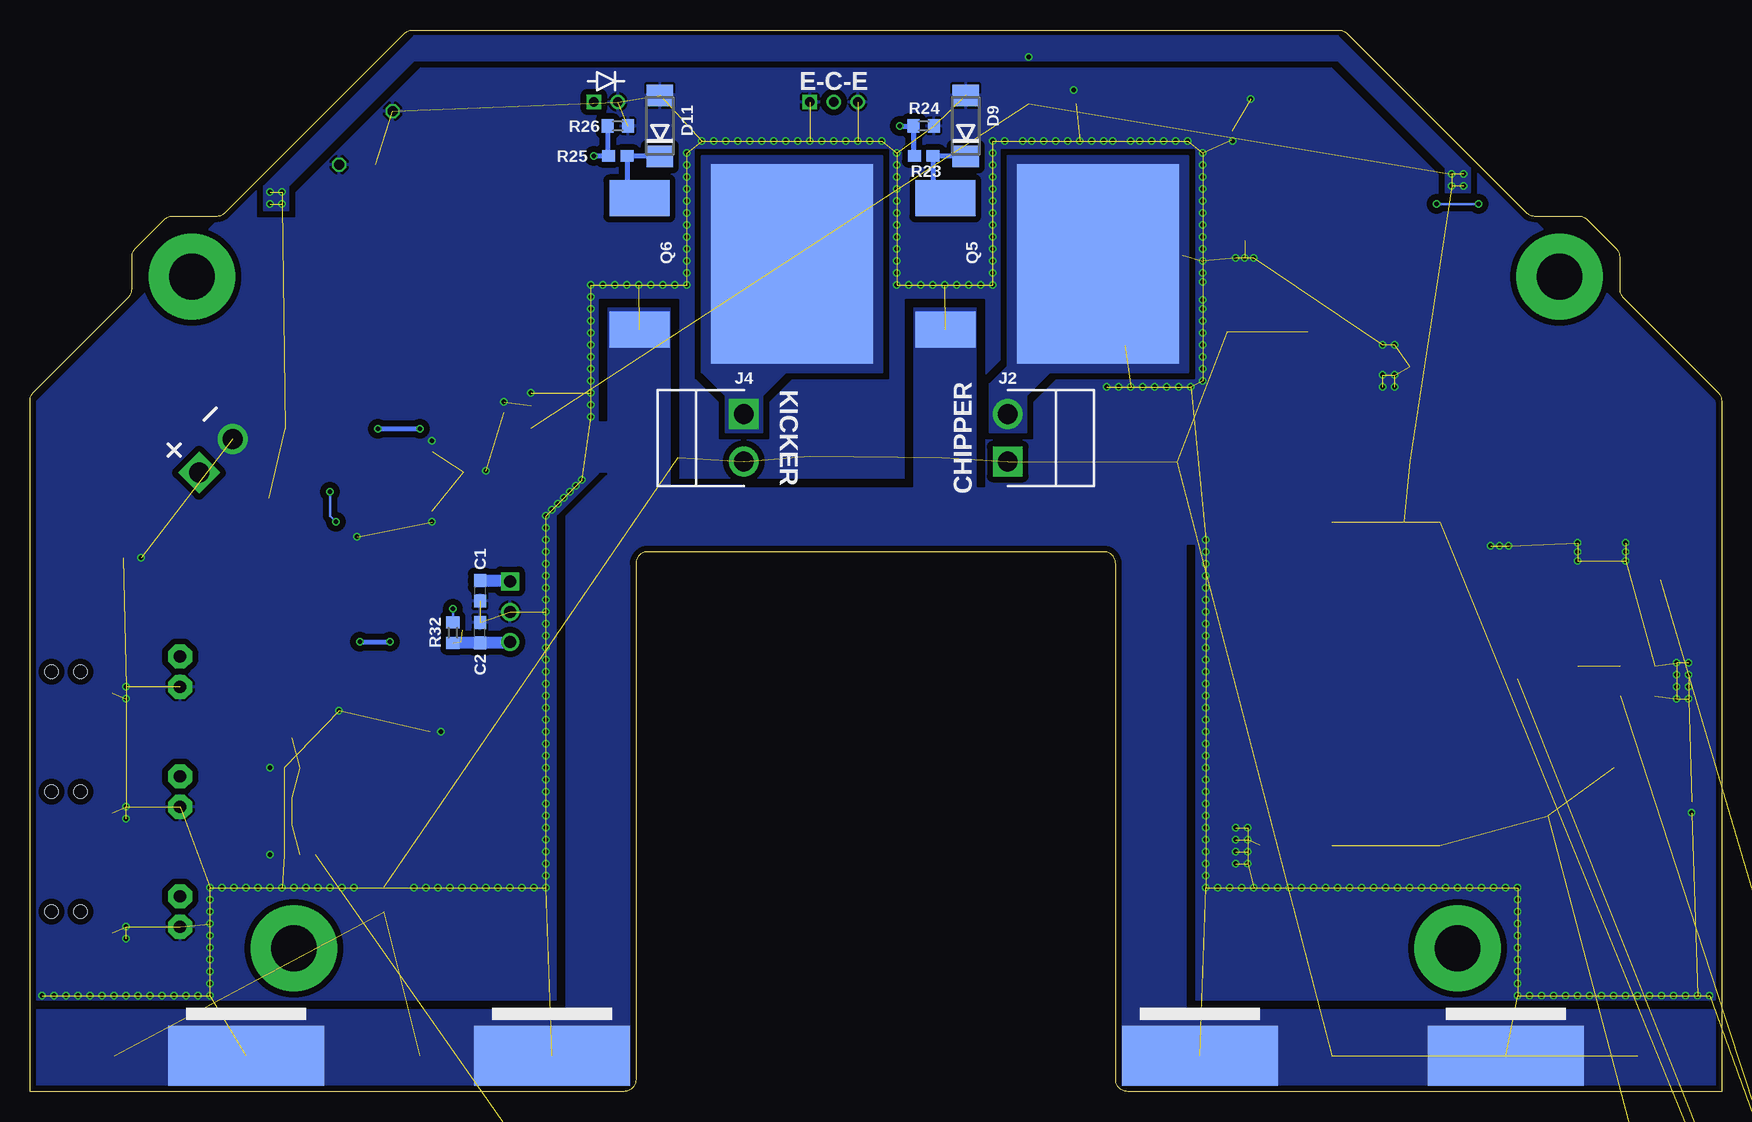
[diagram p8: board, bottom side, seen from below]

Size 141 x 88.5 mm. Coordinates in mm from the lower left corner, seen from the top.
Outline: 0,0 49.5,0 arc90 50.5,1 50.5,44 arc-90 51.5,45 89.5,45 arc-90 90.5,44 90.5,1 arc90 91.5,0 141,0 141,57.59 arc45 140.71,58.29 132.79,66.21 arc-45 132.5,66.91 132.5,69.59 arc45 132.21,70.29 129.79,72.71 arc45 129.09,73 125.41,73 arc-45 124.71,73.29 109.79,88.21 arc45 109.09,88.5 31.91,88.5 arc45 31.21,88.21 16.29,73.29 arc-45 15.59,73 11.91,73 arc45 11.21,72.71 8.79,70.29 arc45 8.5,69.59 8.5,66.91 arc-45 8.21,66.21 0.29,58.29 arc45 0,57.59 0,0
Copper layers (1*16): Top 0.035mm / dielectric 1.55mm / Bottom 0.035mm
Design rules "eC_2Layer_PClass6_BaseCopperO35 *": minimum track width 0.15mm, minimum drill 0.35mm, track to track 0.175mm, track to pad 0.175mm, pad to pad 0.175mm, via to via 0.175mm, smd to smd 0mil, copper to edge 0.25mm, drill to drill 0.35mm, minimum pad ring 0.175mm, minimum via ring 0.125mm, stop-mask expansion 0mil, vias tented up to drill 0.45mm, thermal gap 0.2mm
vRestrict: area 18.2,8.2 to 25.8,15.7; area 115.2,8.2 to 122.8,15.7; area 9.8,64.2 to 17.2,71.7; area 123.8,64.2 to 131.2,71.7

### Footprints (pad centres in the part's own frame; a part is rotated, then mirrored left to right if it is on the bottom)
C0603 = smd 1.1 x 1: 1 -0.85,0; 2 0.85,0
UD-10X10_NICHICON = smd 3.6 x 1.3: + 3.925,0; - -3.95,0
25MM-DIA_40MM-HGT_HORIZ = smd 13 x 5: + -5.5,0 | smd 13 x 5 bottom: - 5.5,0
25MM-DIA_40MM-HGT_HORIZ_MIRRORED = smd 13 x 5: + 5.5,0 | smd 13 x 5 bottom: - -5.5,0
C0805 = smd 1.3 x 1.5: 1 -0.95,0; 2 0.95,0
DO-214AB = smd 1.6 x 3.3: A 3.145,0; C -3.145,0
CHIP-LED0603 = smd 0.8 x 0.8: A 0,-0.75; C 0,0.75
DO214AA = smd 1.8 x 2.2: A 2.55,0; C -2.55,0
F1206 = smd 1.6 x 1.803: 1 -1.422,0; 2 1.422,0
B2PS-CENTERED = drill 1.65 square: 1 -1.98,0 | drill 1.65: 2 1.98,0
HFW8R-1ST = smd 0.6 x 2: 1 -3.5,3.25; 2 -2.5,3.25; 3 -1.5,3.25; 4 -0.5,3.25; 5 0.5,3.25; 6 1.5,3.25; 7 2.5,3.25; 8 3.5,3.25 | smd 0.7 x 4.2: LEG1 -4.5,1.15; LEG2 4.5,1.15
2MM-2-V = drill 0.8 square: 1 -1,0 | drill 0.8: 2 1,0
2MM-3-V = drill 0.8 square: 1 -2,0 | drill 0.8: 2 0,0; 3 2,0
1X2 = drill 1.016 pad 2 octagon: 1 -1.27,0; 2 1.27,0
D2PAK = smd 2.083 x 3.81: 1 -2.54,-8.89; 3 2.54,-8.89 | smd 11.43 x 8.89: 2 0,2.54
SOT-23-3 = smd 0.7 x 1: 1 -0.95,-1.2; 2 0.95,-1.2; 3 0,1.2
DPAK = smd 1.5 x 2.5: 1 -2.3,-6.25; 3 2.3,-6.25 | smd 7 x 7: FIN 0,0
TO-268 = smd 3 x 5: 1 -5.46,-12.7; 3 5.46,-12.7 | smd 16.6 x 13.5: 4 0,0
R0805 = smd 1.3 x 1.5: 1 -0.95,0; 2 0.95,0
R0603 = smd 1 x 1.1: 1 -0.85,0; 2 0.85,0
R1206 = smd 1.6 x 1.803: 1 -1.422,0; 2 1.422,0
DPAK_TDH = smd 2.32 x 3.81: 1 -2.54,-11.17; 2 2.54,-11.17 | smd 11 x 9.65: 3 0,0
R0603W = smd 1.09 x 0.94: 1 -0.775,0; 2 0.775,0
CSS-121XB = smd 1 x 2.5: 1 -3,3.75; 2 -1,3.75; 3 1,3.75 | drill 0.8 pad 1.2 octagon: LEG1 -3.15,0; LEG4 3.15,0
HDP001R = smd 1.8 x 1.5: A -1.75,-3.85; B 1.75,-3.85 | smd 1.7 x 1.6: C -3.65,0; D 3.65,0 | hole 1.1: 0,1.2; 0,-1.2
DA2034 = smd 3.3 x 1.27: 1 -13.46,7.5; 2 -13.46,4.5; 3 -13.46,1.5; 4 -13.46,-1.5; 5 -13.46,-4.5; 6 -13.46,-7.5; 7 13.46,-7.5; 8 13.46,-4.5; 9 13.46,-1.5; 10 13.46,1.5; 11 13.46,4.5; 12 13.46,7.5
R-78E = drill 1 square: 1 -2.54,0 | drill 1: 2 0,0; 3 2.54,0
SOIC-8 = smd 0.6 x 2.2: 1 -1.905,-2.6; 2 -0.635,-2.6; 3 0.635,-2.6; 4 1.905,-2.6; 5 1.905,2.6; 6 0.635,2.6; 7 -0.635,2.6; 8 -1.905,2.6
SOIC-20 = smd 0.6 x 2.2: 1 -5.715,-4.6; 2 -4.445,-4.6; 3 -3.175,-4.6; 4 -1.905,-4.6; 5 -0.635,-4.6; 6 0.635,-4.6; 7 1.905,-4.6; 8 3.175,-4.6; 9 4.445,-4.6; 10 5.715,-4.6; 11 5.715,4.6; 12 4.445,4.6; 13 3.175,4.6; 14 1.905,4.6; 15 0.635,4.6; 16 -0.635,4.6; 17 -1.905,4.6; 18 -3.175,4.6; 19 -4.445,4.6; 20 -5.715,4.6
SOT-23-6 = smd 0.55 x 1.2: 1 -0.95,-1.3; 2 0,-1.3; 3 0.95,-1.3; 4 0.95,1.3; 5 0,1.3; 6 -0.95,1.3
QFN50P400X500X80-21N = smd 0.813 x 0.305: 1 -1.956,1.245; 2 -1.956,0.762; 3 -1.956,0.254; 4 -1.956,-0.254; 5 -1.956,-0.762; 6 -1.956,-1.245; 11 1.956,-1.245; 12 1.956,-0.762; 13 1.956,-0.254; 14 1.956,0.254; 15 1.956,0.762; 16 1.956,1.245 | smd 0.305 x 0.813: 7 -0.762,-2.464; 8 -0.254,-2.464; 9 0.254,-2.464; 10 0.762,-2.464; 17 0.762,2.464; 18 0.254,2.464; 19 -0.254,2.464; 20 -0.762,2.464 | smd 2.642 x 3.658: 21 0,0

### Placement (x,y rotation side)
C1  103.5,41.75 270 bottom
C2  103.5,38.25 90 bottom
C3  2.5,25 270 top
C4  26,56.5 270 top
C5  -27.5,-153.5 0 top  (outside the outline)
C6  -27.5,-158.5 0 top  (outside the outline)
C7  -27.5,-163.5 0 top  (outside the outline)
C10  12.5,3 0 top
C11  38,3 0 top
C12  128.5,3 0 top
C13  103,3 0 top
C14  101.5,55.75 90 top
C15  99.25,56.25 90 top
C16  114.5,33 0 top
D1  42.25,52.5 180 top
D2  -28,-172 0 top  (outside the outline)
D3  42.5,87 270 top
D4  39.75,73.5 270 top
D5  37.5,87 270 top
D6  47.5,87 270 top
D7  47.5,69.75 180 top
D8  65,56 90 top
D9  63,80.5 90 bottom
D10  87,56 90 top
D11  88.5,80.5 90 bottom
D12  -28,-184 0 top  (outside the outline)
F1  122.5,49.5 180 top
J1  125.5,53 135 top
J2  59.5,54.5 90 bottom
J3  136.5,46 90 top
J4  81.5,54.5 270 bottom
J5  93,82.5 180 top
J6  74,82.5 180 top
J7  128.5,25 270 top
J8  128.5,35 270 top
J9  128.5,15 270 top
Q1  14.5,25.5 180 top
Q2  42,81 270 top
Q3  52.5,81.5 90 top
Q4  56,64.5 270 top
Q5  52,69 270 bottom
Q6  77.5,69 270 bottom
R1  5.75,27 0 top
R2  -29,-103.5 0 top  (outside the outline)
R3  -29,-175.5 0 top  (outside the outline)
R4  -29,-108.5 0 top  (outside the outline)
R5  -29,-187.5 0 top  (outside the outline)
R6  -29,-113.5 0 top  (outside the outline)
R7  -29,-118.5 0 top  (outside the outline)
R8  7,35.5 0 top
R9  7,33 0 top
R11  -29,-123.5 0 top  (outside the outline)
R13  34.5,64.25 270 top
R14  36.75,64.25 270 top
R15  36.75,68.5 270 top
R16  33.5,82.75 180 top
R17  41.25,64.25 270 top
R18  75.5,73 0 top
R19  39,64.25 270 top
R20  46,66.75 180 top
R21  57.75,81.5 90 top
R22  55.5,81.5 270 top
R23  66.5,78 0 bottom
R24  66.5,80.5 180 bottom
R25  92,78 0 bottom
R26  92,80.5 180 bottom
R27  111.5,18 270 top
R28  111.5,22.5 270 top
R29  107.5,52.5 270 top
R30  107.5,49.25 90 top
R31  108.5,30 0 top
R32  105.75,38.25 270 bottom
R33  113.75,47.5 0 top
R34  98.5,78.5 90 top
R35  108.25,74.25 270 top
R36  120,29.5 180 top
R37  120,24.5 180 top
R38  120,22.25 180 top
R40  -29,-128.5 0 top  (outside the outline)
R41  -29,-133.5 0 top  (outside the outline)
R42  -29,-138.5 0 top  (outside the outline)
R43  -29,-143.5 0 top  (outside the outline)
R44  -29,-148.5 0 top  (outside the outline)
S1  113,79.5 135 top
S2  138,35 270 top
S3  138,25 270 top
S4  138,15 270 top
T1  31,34 270 top
U1  101,40 270 top
U3  102.25,51 90 top
U4  114.5,40 0 top
U5  118.5,27 90 top
U6  118.5,19.75 90 top
U7  -26.5,-69.5 0 top  (outside the outline)
U$1  [HV_WARNING]  29,9 0 top
U$2  [HV_WARNING]  97.5,9 0 top
U$4  [WARNING2]  44.5,86 180 top

### Tracks (layer width: path | path; a pad name or v marks a point on that pad's centre or on a via)
!BTN_CHG
  Top 0.2: U4.2 110.06,33.45 112,31.5 112,28.5 116,24.5 116,21 116.3,20.7 U6.4
!BTN_CHG_PRE
  Top 0.2: U6.3 120.85,20.7 | R38.1 120.85,20.7 | 128.5,18.65 J9.1 | 128.5,18.65 S4.C | 128.5,18.65 126.45,20.7 120.85,20.7
!BTN_CHP
  Top 0.2: U4.10 120.22,32.72 119.5,32 118,32 117.2,31.2 U5.4
!BTN_CHP_PRE
  Top 0.2: U5.3 120.2,27.95 120.85,28.6 R36.1 124.5,29.5 125.5,30.5 125.5,35.5 126.27,36.27 J8.1 130.88,38.65 S2.C
!BTN_KCK
  Top 0.2: U5.6 115.45,26.05 112.59,28.91 U4.4
!BTN_KCK_PRE
  Top 0.2: 120.2,26.05 U5.1 120.85,26.05 | R37.1 120.85,26.05 | 120.85,26.05 128.28,26.05 J7.1 130.88,28.65 S3.C
!KICKER_SELECT
  Top 0.2: J3.5 131,46.5 129,44.5 123.5,44.5 122.5,43.5 122.5,40 121,38.5 119.5,38.5 118.94,37.95 U4.9
!RESET  (via drill 0.35)
  Top 0.2: v105.75,40.25 105.75,41.25 107,42.5 120,42.5 120.22,42.72 U4.11 120.22,45.47 121.25,46.5 128,46.5 133,51.5 137.5,51.5 138,51 138,46.5 137,45.5 J3.4
  Bottom 0.2: R32.1 v105.75,40.25
+5V  (via drill 0.35)  (7 unrouted)
  Top 0.2: 105.1,37.5 105,37.4 | 105,38.5 105,41.5 106.5,43 114.75,43 115.13,43.38 U4.15 115.13,46.12 114.6,46.65 R33.2 v115.5,47.5 | S1.1 111.25,73.51 111.25,54.25 113.25,52.25 113.25,50.25 113.5,50 v116,50 | U6.5 118.5,19.75
  Top 0.4: v113.5,37.5 113.87,37.14 U4.5 113.87,33.22 C16.1 113.65,28.85 115.5,27 U5.5 118.5,27 | v111,37.5 105.1,37.5
  Bottom 0.2: v116,50 116,48 v115.5,47.5
  Bottom 0.4: v113.5,37.5 v111,37.5
  Bottom 1: U1.3 101.06,37.4 C2.1 R32.2
  pour Top: 99.5,38.75 105.5,38.75 105.5,36 99.5,36
  pour Top (no thermals): 118,30 119,30 119,18.5 118,18.5
+18.5V  (via drill 0.35)  (28 unrouted)
  Top 0.2: R21.2 v57.75,86.25
  Top 0.4: C15.1 99.65,54.9 C14.1 101.85,55.25 v108.5,55.25 | U3.6 102,51.63 | 119.75,55.25 v112,55.25
  Top 1: C14.1 101.5,54 102,53.5 102,51.63 102,45.5 101,44.5 U1.1
  Bottom 0.4: v108.5,55.25 v112,55.25
  Bottom 1: C1.1 101.06,42.6 U1.1
  other vias: 21.5,75.5 22.5,75.5 21.5,76.5 22.5,76.5 120,75 121,75 121,74 120,74
  pour Top: 21,45 34,45 34,49.5 31,49.5 29.5,51 29.5,55 23,55 23,77 21,77
  pour Bottom (no thermals): 21,77 32,88 109,88 121.5,75.5 121.5,73.5 119.5,73.5 119.5,75.5 109,86 32,86 23,77 23,75 21,75
  pour Top (no thermals): 121.5,48.5 121.5,75.5 119.5,75.5 119.5,48.5
BB_RX
  Top 0.2: U4.17 112.59,46.09 112.9,46.4 R33.1 112.9,48.35 111.75,49.5 111.75,51.5 109.75,53.5 109.75,56.25 108.5,57.5 104,57.5 99,62.5 99,74.75 94.5,79.25 93.5,79.25 91.25,81.5 75,81.5 J6.2
BB_TX
  Top 0.2: U4.14 116.41,47.59 115,49 113,49 112.25,49.75 112.25,51.75 110.25,53.75 110.25,56.5 108.5,58.25 104.25,58.25 99.5,63 99.5,75 98.5,76 R34.1
CHARGE  (via drill 0.35)  (1 unrouted)
  Top 0.2: 5.1,42.65 4.75,43 4.75,52.25 18.5,66 18.5,72.25 v20.25,74 | U4.18 111.33,51.17 109.25,53.25 109.25,56 108.5,56.75 103.75,56.75 98.5,62 98.5,74.5 94.25,78.75 93.25,78.75 91,81 70,81 69.5,81.5 65,81.5 58.75,87.75 34.25,87.75 32.65,86.15 R16.2 32.5,82.75 v23.75,74
  Bottom 0.2: v20.25,74 v23.75,74
CHIP
  Top 0.4: U4.20 108.78,48.97 107.65,50.1 R30.2 107.23,50.37 U3.2
CHIP_GATE  (via drill 0.35)
  Top 0.4: v68.5,80.5 90.5,80.5 93.25,77.75 93.25,75.75 97,72 97,51.5 98.14,50.37 U3.7
  Bottom 0.4: v68.5,80.5 R24.2 67.35,78.08 R23.1
CHIPPER
  pour Bottom (no thermals): 44.5,78 59.5,78 59.5,60.5 61,59 61,55 58,55 58,58 56,60 44.5,60
  pour Top (no thermals): 58,55 61,55 64,58 67,58 67,60 63,60 61,58 58,58
GATE_CONTROL  (1 unrouted)
  Top 0.2: 9.5,38 10.5,37 16.5,37 17.04,36.46 Q1.1
GND  (via drill 0.35 pad 0.35)  (387 unrouted)
  Top 0.2: R22.1 53.8,82.35 Q3.2 54,82.45 v54,83.5 | Q2.2 40.8,79.3 v40.75,79.25 | U4.6 115.13,33.22 C16.2 115.35,31.85 v115.25,31.75 | J3.3 v131.75,44.5 | v39.25,82.75 39.25,86 D5.C | U5.2 v121,27 | U6.2 v121,19.75 | S1.LEG1 112.19,77.27 S1.2 | v106.75,30 R31.1
  Top 0.4: C3.2 v2.5,23.25 | R29.1 v107.5,54.25 | U3.3 103.12,51.63 v103,51.75 | R30.1 v107.5,47.5 | C15.2 v99.25,58.25 | C14.2 v101.5,57.5 | U4.16 113.87,46.13 v113.75,46.25
  other vias: 3.75,35.75 3.75,34.75 3.75,33.75 3.75,32.75 2.75,32.75 2.75,33.75 2.75,34.75 2.75,35.75 39.5,19 39.5,20 39.5,21 39.5,22 40.5,22 40.5,21 40.5,20 40.5,19 28.25,59.75 27.25,59.75 28.25,62.25 27.25,62.25 27.25,58.75 28.25,58.75 17.75,45.5 19.25,45.5 18.5,45.5 8,45.75 8,44.25 12,44.25 12,45.75 12,45 8,45 68.75,77.25 68.75,78.25 68.75,76.25 68.75,75.25 68.75,72.25 68.75,73.25 68.75,74.25 68.75,71.25 68.75,70.25 68.75,67.25 68.75,68.25 68.75,69.25 60.75,77.25 60.75,78.25 60.75,76.25 60.75,75.25 60.75,72.25 60.75,73.25 60.75,74.25 60.75,71.25 60.75,70.25 60.75,67.25 60.75,68.25 60.75,69.25 61.75,67.25 62.75,67.25 65.75,67.25 64.75,67.25 63.75,67.25 66.75,67.25 86.25,78.25 86.25,77.25 86.25,76.25 86.25,73.25 86.25,74.25 86.25,75.25 86.25,72.25 86.25,71.25 86.25,68.25 86.25,69.25 86.25,70.25 86.25,67.25 87.25,67.25 90.25,67.25 89.25,67.25 88.25,67.25 91.25,67.25 92.25,67.25 70,79.25 73,79.25 72,79.25 71,79.25 74,79.25 75,79.25 78,79.25 77,79.25 76,79.25 79,79.25 80,79.25 83,79.25 82,79.25 81,79.25 84,79.25 85,79.25 44.5,79.25 47.5,79.25 46.5,79.25 45.5,79.25 48.5,79.25 52.5,79.25 51.5,79.25 53.5,79.25 54.5,79.25 57.5,79.25 56.5,79.25 55.5,79.25 43.25,77.25 43.25,78.25 43.25,76.25 43.25,75.25 43.25,72.25 43.25,73.25 43.25,74.25 43.25,71.25 43.25,70.25 43.25,68.25 43.25,69.25 43.25,65.25 43.25,62.25 43.25,63.25 43.25,64.25 43.25,61.25 44.25,58.75 45.25,58.75 46.25,58.75 47.25,58.75 48.25,58.75 49.25,58.75 43.25,60.25 67.75,67.25 93.25,67.25 94.25,67.25 94.25,66.25 94.25,65.25 94.25,64.25 94.25,63.25 94.25,62.25 94.25,61.25 94.25,60.25 94.25,59.25 94.25,58.25 94.25,57.25 94.25,56.25 49.25,79.25 50.75,79.25 58.25,79.25 59.75,79.25 39,69.5 39.75,69.5 40.5,69.5 43.25,67.5 43.25,66 133,13.75 133,23.75 133,33.75 133,32.75 133,22.75 133,12.75 98,47 98,46 98,45 98,44 98,43 98,42 98,41 98,40 98,39 98,38 98,37 98,36 98,35 98,34 98,33 98,32 98,31 98,30 98,29 98,28 98,27 98,26 98,25 98,24 98,23 98,22 98,21 98,20 98,19 98,18 98,17 43,46 43,45 43,44 43,43 43,42 43,41 43,40 43,39 43,38 43,37 43,36 43,35 43,34 43,33 43,32 43,31 43,30 43,29 43,28 43,27 43,26 43,25 43,24 43,23 43,22 43,21 43,20 43,19 43,18 43,17 98,48 97.5,48.5 96.5,49.5 97,49 96,50 95.5,50.5 95,51 50.25,58.75 51.25,58.75 99,17 100,17 101,17 102,17 103,17 104,17 105,17 106,17 107,17 108,17 109,17 126,17 125,17 124,17 123,17 122,17 121,17 120,17 119,17 118,17 117,17 116,17 115,17 114,17 138,8 137,8 136,8 135,8 134,8 133,8 132,8 131,8 130,8 129,8 128,8 127,8 126,8 139,8 140,8 126,9 126,10 126,11 126,12 126,13 126,14 126,15 126,16 12,8 11,8 10,8 9,8 8,8 7,8 6,8 5,8 4,8 3,8 2,8 1,8 29,17 28,17 27,17 26,17 25,17 24,17 23,17 22,17 21,17 20,17 19,17 18,17 17,17 42,17 41,17 40,17 39,17 38,17 37,17 36,17 35,17 34,17 33,17 32,17 31,17 30,17 17,16 17,15 17,14 17,13 17,12 17,11 17,10 17,9 17,8 16,8 15,8 14,8 13,8 60.75,79.25 43.25,59.25
  pour Bottom (isolate 0.5, rank 6): 0.5,6.5 0.5,57.5 31,88 110,88 140.5,57.5 140.5,6.5
  pour Bottom (isolate 0.5, no thermals): 0.5,8 140.5,8 140.5,0.5 0.5,0.5
  pour Top: 94,51.5 97.5,48 97.5,16.5 109.5,16.5 109.5,17.5 98.5,17.5 98.5,48 95,51.5
  pour Top: 43.5,16.5 17.5,16.5 17.5,7.5 0.5,7.5 0.5,8.5 16.5,8.5 16.5,17.5 42.5,17.5 42.5,46.5 43.5,46.5
  pour Top (no thermals): 2.5,36 6,36 6,32.5 2.5,32.5
  pour Top (no thermals): 37.5,22.5 41,22.5 41,18.5 37.5,18.5
  pour Top: 25,63 29,63 29,58 25,58
  pour Top (no thermals): 17.5,46 19.5,46 19.5,43.5 17.5,43.5
  pour Top (no thermals): 7.5,44 7.5,46 8.5,46 8.5,45 11.5,45 11.5,46 12.5,46 12.5,44
  pour Top (no thermals): 43,58.5 43,66.25 43.5,66.25 43.5,63.5 51.5,63.5 51.5,58.5
  pour Top (no thermals): 43,71 46,71 46,68.5 43,68.5
  pour Top (no thermals): 38.5,69 38.5,72 41,72 41,69
  pour Top (no thermals): 132.5,34.5 135.5,34.5 135.5,32 132.5,32
  pour Top (no thermals): 132.5,24.5 135.5,24.5 135.5,22 132.5,22
  pour Top (no thermals): 132.5,14.5 135.5,14.5 135.5,12 132.5,12
  pour Bottom (no thermals): 86.5,66 94,66 94,61.5 86.5,61.5
  pour Bottom (no thermals): 61,66 68.5,66 68.5,61.5 61,61.5
  pour Bottom (no thermals): 121.5,54.5 124,57 126.5,54.5 124,52
  pour Top: 113.5,17.5 126.5,17.5 126.5,8.5 140.5,8.5 140.5,7.5 125.5,7.5 125.5,16.5 113.5,16.5
  pour Top: 94,56 94.5,56 94.5,67.5 86.5,67.5 86.5,79.5 68.5,79.5 68.5,67.5 61,67.5 61,79.5 59.5,79.5 59.5,79 60.5,79 60.5,67 69,67 69,79 86,79 86,67 94,67
  pour Top: 49.5,79.5 43.5,79.5 43,79 43,67.25 43.5,67.25 43.5,78.5 44,79 49.5,79
  pour Top: 50.5,79.5 58.5,79.5 58.5,79 50.5,79
HOLE1  (via drill 3.8 pad 7.2)
  other vias: 13.5,67.94
HOLE2  (via drill 3.8 pad 7.2)
  other vias: 127.5,67.94
HOLE3  (via drill 3.8 pad 7.2)
  other vias: 22,11.94
HOLE4  (via drill 3.8 pad 7.2)
  other vias: 119,11.94
HV_AC
  pour Top (no thermals): 40,54.5 37.5,54.5 37.5,45.5 39.5,45.5 39.5,50.5 40,50.5
INTVCC
  pour Top: 12,41.5 13,41.5 13,40.5 20,40.5 20,37.5 12,37.5
KICK
  Top 0.4: U4.19 110.06,51.2 109.6,51.65 R29.2 107.35,51.65 106.09,52.91 U3.4
KICK_GATE  (via drill 0.35)
  Top 0.4: U3.5 98.34,52.91 97.75,53.5 97.75,72.25 94,76 v94,78
  Bottom 0.4: v94,78 R25.1 92.85,78.08 R26.2
KICKER
  pour Bottom (no thermals): 70,78 85,78 85,60 83,58 83,55 80,55 80,58 78,60 70,60
  pour Top (no thermals): 80,58 83,58 85,60 89,60 89,58 86,58 83,55 80,55
MISO
  Top 0.2: U4.3 111.33,36.83 114.5,40 120.25,40 121,40.75 121,44.25 122.75,46 128.25,46 131.75,49.5 J3.8
MODE_SELECT
  Top 0.2: R35.2 108.25,59.25 110.75,56.75 110.75,54 112.75,52 112.75,50 113.25,49.5 115.25,49.5 117.67,47.08 U4.13
MOSI
  Top 0.2: J3.7 131.5,48.5 128.5,45.5 123,45.5 121.5,44 121.5,40.5 120.5,39.5 119,39.5 116.41,36.91 U4.7
N$1  (1 unrouted)
N$2
  Top 0.2: R17.1 41.25,66.25 41.75,66.75 R20.2
N$3
  Top 0.2: R13.1 34.5,69.75 36.25,71.5 36.25,78.75 40.25,82.75 40.25,86.25 41,87 D3.A
N$4
  Top 0.2: D3.C 43.2,87 Q2.3
N$5
  Top 0.2: R16.1 34.35,86.35 35,87 D5.A
N$6
  Top 0.2: R34.2 95.15,79.35 94,80.5 J5.1
N$7
  Bottom 0.4: D9.C 63.05,78 R23.2 65.72,75.48 Q5.1
N$8
  Bottom 0.4: D11.C 88.55,78 R25.2 91.22,75.48 Q6.1
N$9
  cutout Bottom: 0.5,7.5 44,7.5 44,45.5 44.5,45.5 44.5,7 0.5,7
N$10
  Top 0.2: Q3.1 55.4,80.55 R22.2 R21.1
N$11
  Top 0.2: R15.2 R14.1
N$12
  Top 0.2: D6.C 58,87 59,86 59,67.5 Q4.FIN
  Top 1: Q4.FIN 66.5,64.5 69.17,61.83 R18.1
N$13
  Top 0.2: R19.1 39,66 42,69 42,79 43,80 45,80 45.5,80.5 45.5,86.5 46,87 D6.A
N$14
  Top 0.2: S1.3 108.25,76.16 R35.1
N$15
  Top 0.2: R28.2 R27.1
N$16
  cutout Bottom: 93,51.5 93.5,51.5 97,48 97,7.5 140.5,7.5 140.5,7 96.5,7 96.5,48
N$17
  cutout Bottom: 93,56 93.5,56 93.5,66 87,66 87,51 68,51 68,66 61.5,66 61.5,50.5 62,50.5 62,65.5 67.5,65.5 67.5,50.5 87.5,50.5 87.5,65.5 93,65.5
N$18  (1 unrouted)
N$19  (1 unrouted)
N$20  (1 unrouted)
N$21
  Top 0.2: R15.1 36.75,74.75 38.05,76.05 D4.C 39.75,81.5 40.2,81.95 Q2.1
N$22  (1 unrouted)
N$23  (1 unrouted)
N$24  (1 unrouted)
N$25  (1 unrouted)
N$26  (1 unrouted)
N$27  (1 unrouted)
N$28  (1 unrouted)
N$29  (1 unrouted)
N$32
  Top 0.4: R1.1 3.65,27 C3.1
QUICK_DISCHARGE
  Top 0.2: Q3.3 50.05,80.25 D7.C 50.05,67.1 Q4.1 49.7,66.75 R20.1
SCK
  Top 0.2: J3.6 131.25,47.5 128.75,45 123.25,45 122,43.75 122,40.25 120.75,39 119.25,39 117.67,37.42 U4.8
SENSE  (2 unrouted)
  Top 0.2: R8.2 7.75,36.17 7.75,37.5 | 7.75,37.5 7.75,37.65 | 7.75,37.5 7.75,38.3
  Top 0.4: Q1.3 11.96,35.5 | R8.2 R9.2
V+  (14 unrouted)
  Top 0.2: R27.2 111.5,15
  Top 1: R18.2 78.04,59.04 76,57 76,53
  pour Top (isolate 0.5, no thermals): 50.5,0.5 0.5,0.5 0.5,5.5 28.5,5.5 28.5,15.5 44.5,15.5 44.5,56 31.75,56 31.75,63.25 42,63.25 42,57.5 51.5,57.5 51.5,54 93,54 93,51 96.5,47.5 96.5,15.5 112.5,15.5 112.5,5.5 140.5,5.5 140.5,0.5 90.5,0.5 90.5,45 50.5,45
VBATT
  Top 1.5: F1.1 124.8,49.5 J1.1
VMON
  Top 0.2: U4.1 108.78,33.97 109.35,33.4 R31.2 110.5,30 111.5,29 R28.1
VSN  (7 unrouted)
  Top 0.4: R1.2 9,27
  pour Top (no thermals): 8.5,28 21,28 21,22.5 33.5,22.5 33.5,18.5 8.5,18.5

### Text on the board
tPlace: CHG | DIS / CHG | DEBUG | NORMAL | Kicker V2.1 | CHIPPER | KICKER | MISO | MOSI | HIGH VOLTAGE | SCK | !KICKER_SELECT | !RESET | CHIP | HIGH VOLTAGE | HIGH VOLTAGE | KICK | CHARGE | +250V | +250V
bPlace: E-C-E | CHIPPER | KICKER